# Altium project bms_afe_tester-1_1.PrjPcb (part 1 of 2)
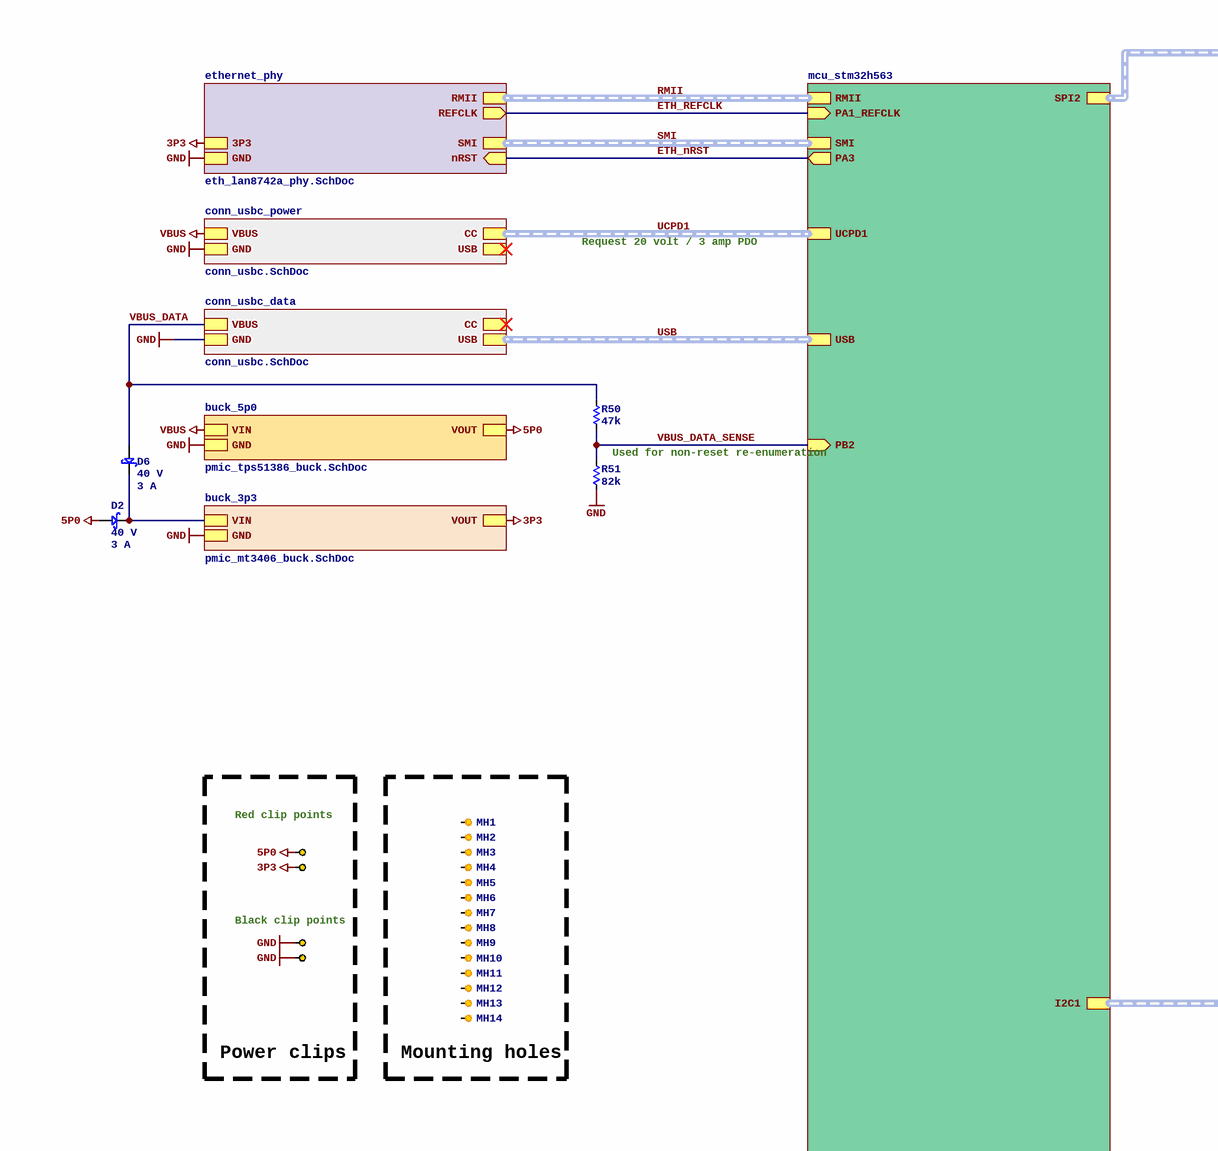
[diagram p0: top.SchDoc, top left]
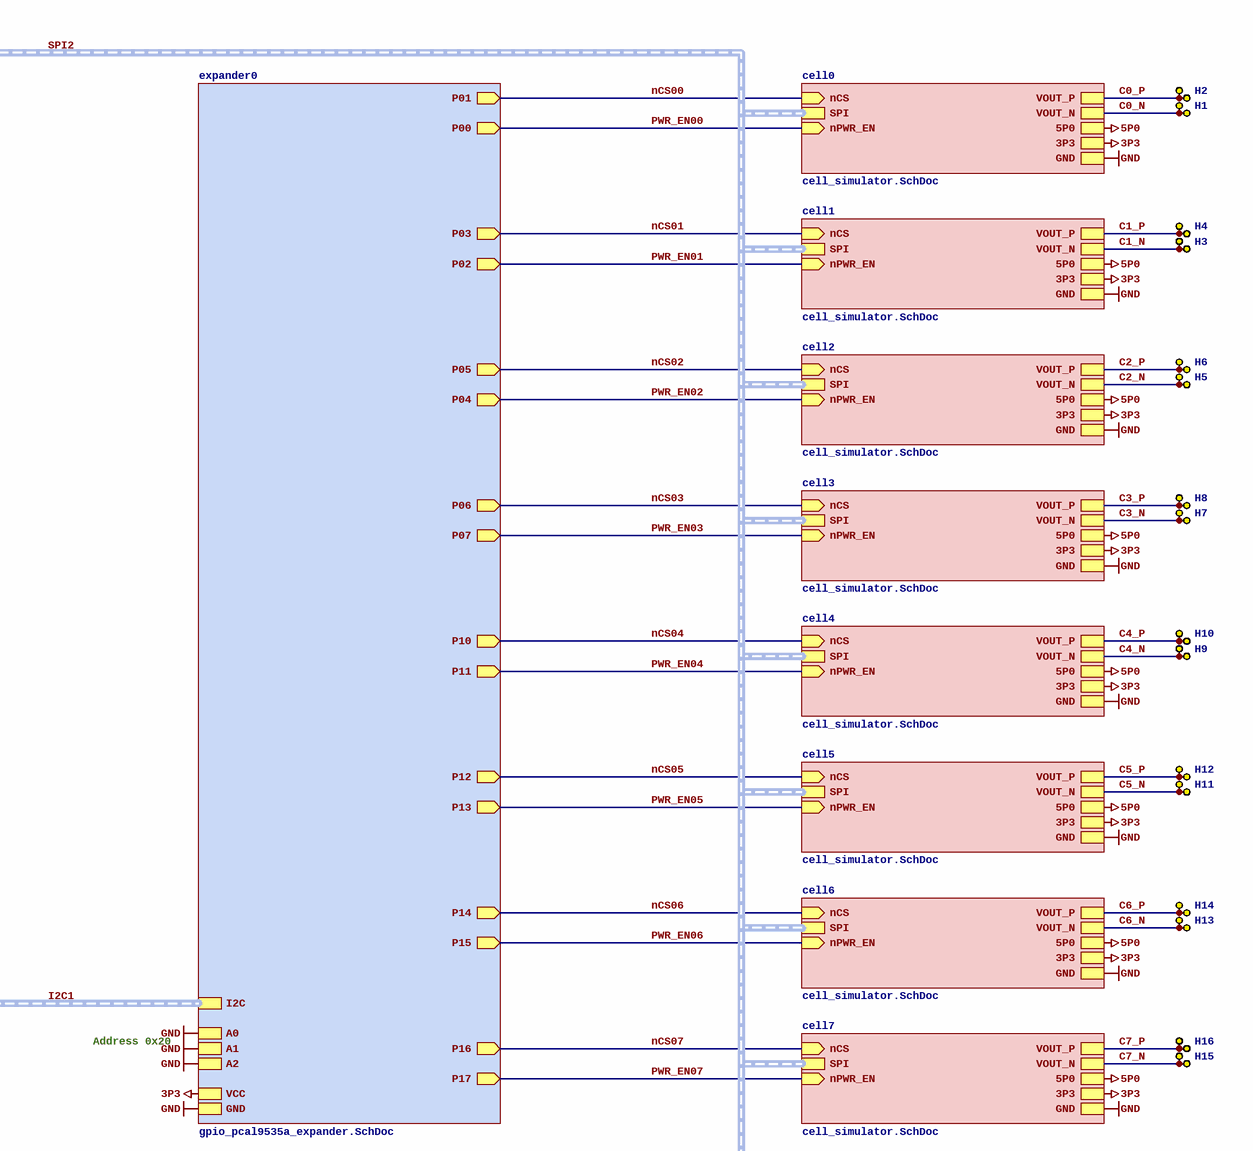
[diagram p1: top.SchDoc, top right]
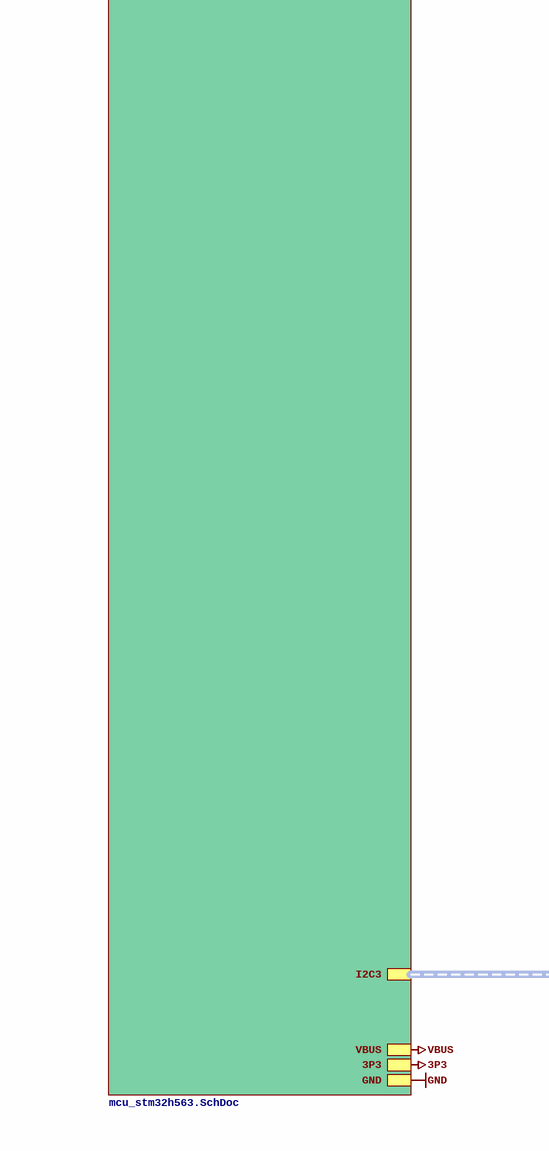
[diagram p2: top.SchDoc, bottom left]
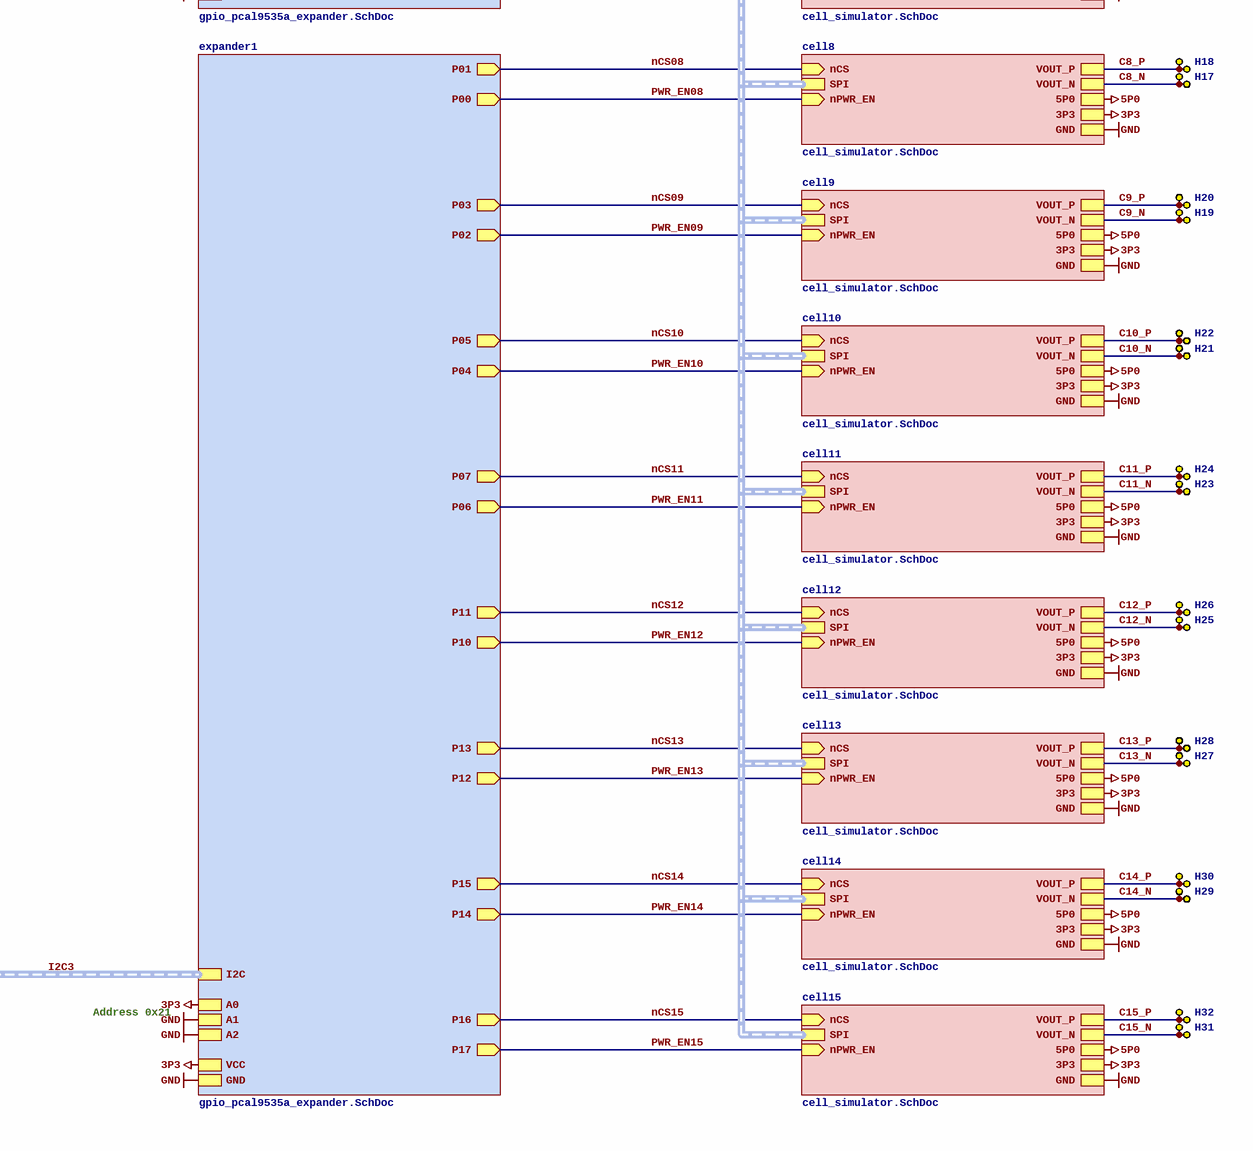
[diagram p3: top.SchDoc, bottom right]
8 sheets, 598 parts. Net scope: strictly hierarchical (ports join the sheet entries above them; power ports are local).
Board file: bms_afe_tester-1_1.PcbDoc
Sheets:
  top.SchDoc
    mcu_stm32h563 = mcu_stm32h563.SchDoc
    conn_usbc_power = conn_usbc.SchDoc
    ethernet_phy = eth_lan8742a_phy.SchDoc
    conn_usbc_data = conn_usbc.SchDoc
    buck_3p3 = pmic_mt3406_buck.SchDoc
    cell0 = cell_simulator.SchDoc
    cell1 = cell_simulator.SchDoc
    cell2 = cell_simulator.SchDoc
    cell3 = cell_simulator.SchDoc
    cell4 = cell_simulator.SchDoc
    cell5 = cell_simulator.SchDoc
    cell6 = cell_simulator.SchDoc
    cell7 = cell_simulator.SchDoc
    cell8 = cell_simulator.SchDoc
    cell9 = cell_simulator.SchDoc
    cell10 = cell_simulator.SchDoc
    cell11 = cell_simulator.SchDoc
    cell12 = cell_simulator.SchDoc
    cell13 = cell_simulator.SchDoc
    cell14 = cell_simulator.SchDoc
    cell15 = cell_simulator.SchDoc
    buck_5p0 = pmic_tps51386_buck.SchDoc
    expander0 = gpio_pcal9535a_expander.SchDoc
    expander1 = gpio_pcal9535a_expander.SchDoc

## Sheet top.SchDoc
size C; SheetNumber: 1

### Parts
D2  Vr: 40 V  Current: 3 A  [SMA]  (hidden comment: B340A-13-F)
D6  Vr: 40 V  Current: 3 A  [SMA]  (hidden comment: B340A-13-F)
H1  SMTSO20100CTJ  [SINHOO_SMTSO20100CTJ]  (value not drawn)
H2  SMTSO20100CTJ  [SINHOO_SMTSO20100CTJ]  (value not drawn)
H3  SMTSO20100CTJ  [SINHOO_SMTSO20100CTJ]  (value not drawn)
H4  SMTSO20100CTJ  [SINHOO_SMTSO20100CTJ]  (value not drawn)
H5  SMTSO20100CTJ  [SINHOO_SMTSO20100CTJ]  (value not drawn)
H6  SMTSO20100CTJ  [SINHOO_SMTSO20100CTJ]  (value not drawn)
H7  SMTSO20100CTJ  [SINHOO_SMTSO20100CTJ]  (value not drawn)
H8  SMTSO20100CTJ  [SINHOO_SMTSO20100CTJ]  (value not drawn)
H9  SMTSO20100CTJ  [SINHOO_SMTSO20100CTJ]  (value not drawn)
H10  SMTSO20100CTJ  [SINHOO_SMTSO20100CTJ]  (value not drawn)
H11  SMTSO20100CTJ  [SINHOO_SMTSO20100CTJ]  (value not drawn)
H12  SMTSO20100CTJ  [SINHOO_SMTSO20100CTJ]  (value not drawn)
H13  SMTSO20100CTJ  [SINHOO_SMTSO20100CTJ]  (value not drawn)
H14  SMTSO20100CTJ  [SINHOO_SMTSO20100CTJ]  (value not drawn)
H15  SMTSO20100CTJ  [SINHOO_SMTSO20100CTJ]  (value not drawn)
H16  SMTSO20100CTJ  [SINHOO_SMTSO20100CTJ]  (value not drawn)
H17  SMTSO20100CTJ  [SINHOO_SMTSO20100CTJ]  (value not drawn)
H18  SMTSO20100CTJ  [SINHOO_SMTSO20100CTJ]  (value not drawn)
H19  SMTSO20100CTJ  [SINHOO_SMTSO20100CTJ]  (value not drawn)
H20  SMTSO20100CTJ  [SINHOO_SMTSO20100CTJ]  (value not drawn)
H21  SMTSO20100CTJ  [SINHOO_SMTSO20100CTJ]  (value not drawn)
H22  SMTSO20100CTJ  [SINHOO_SMTSO20100CTJ]  (value not drawn)
H23  SMTSO20100CTJ  [SINHOO_SMTSO20100CTJ]  (value not drawn)
H24  SMTSO20100CTJ  [SINHOO_SMTSO20100CTJ]  (value not drawn)
H25  SMTSO20100CTJ  [SINHOO_SMTSO20100CTJ]  (value not drawn)
H26  SMTSO20100CTJ  [SINHOO_SMTSO20100CTJ]  (value not drawn)
H27  SMTSO20100CTJ  [SINHOO_SMTSO20100CTJ]  (value not drawn)
H28  SMTSO20100CTJ  [SINHOO_SMTSO20100CTJ]  (value not drawn)
H29  SMTSO20100CTJ  [SINHOO_SMTSO20100CTJ]  (value not drawn)
H30  SMTSO20100CTJ  [SINHOO_SMTSO20100CTJ]  (value not drawn)
H31  SMTSO20100CTJ  [SINHOO_SMTSO20100CTJ]  (value not drawn)
H32  SMTSO20100CTJ  [SINHOO_SMTSO20100CTJ]  (value not drawn)
MH1  HOLE_M3  [HOLE_M3]  (value not drawn)  (no BOM)
MH2  HOLE_M3  [HOLE_M3]  (value not drawn)  (no BOM)
MH3  HOLE_M3  [HOLE_M3]  (value not drawn)  (no BOM)
MH4  HOLE_M3  [HOLE_M3]  (value not drawn)  (no BOM)
MH5  HOLE_M3  [HOLE_M3]  (value not drawn)  (no BOM)
MH6  HOLE_M3  [HOLE_M3]  (value not drawn)  (no BOM)
MH7  HOLE_M3  [HOLE_M3]  (value not drawn)  (no BOM)
MH8  HOLE_M3  [HOLE_M3]  (value not drawn)  (no BOM)
MH9  HOLE_M3  [HOLE_M3]  (value not drawn)  (no BOM)
MH10  HOLE_M3  [HOLE_M3]  (value not drawn)  (no BOM)
MH11  HOLE_M3  [HOLE_M3]  (value not drawn)  (no BOM)
MH12  HOLE_M3  [HOLE_M3]  (value not drawn)  (no BOM)
MH13  HOLE_M3  [HOLE_M3]  (value not drawn)  (no BOM)
MH14  HOLE_M3  [HOLE_M3]  (value not drawn)  (no BOM)
R50  value 47k  [R0402]  (hidden comment: 0402WGF4702TCE)
R51  value 82k  [R0402]  (hidden comment: FRC0402F8202TS)
TP4  RH-5000  [TP_RH-5000]  (value not drawn)
TP5  RH-5001  [TP_RH-5001]  (value not drawn)
TP6  RH-5000  [TP_RH-5000]  (value not drawn)
TP7  RH-5001  [TP_RH-5001]  (value not drawn)
TP8  RH-5000  [TP_RH-5000]  (value not drawn)
TP9  RH-5001  [TP_RH-5001]  (value not drawn)
TP10  RH-5000  [TP_RH-5000]  (value not drawn)
TP11  RH-5001  [TP_RH-5001]  (value not drawn)
TP12  RH-5000  [TP_RH-5000]  (value not drawn)
TP13  RH-5001  [TP_RH-5001]  (value not drawn)
TP14  RH-5000  [TP_RH-5000]  (value not drawn)
TP15  RH-5001  [TP_RH-5001]  (value not drawn)
TP16  RH-5000  [TP_RH-5000]  (value not drawn)
TP17  RH-5001  [TP_RH-5001]  (value not drawn)
TP18  RH-5000  [TP_RH-5000]  (value not drawn)
TP19  RH-5001  [TP_RH-5001]  (value not drawn)
TP20  RH-5000  [TP_RH-5000]  (value not drawn)
TP21  RH-5001  [TP_RH-5001]  (value not drawn)
TP22  RH-5000  [TP_RH-5000]  (value not drawn)
TP23  RH-5001  [TP_RH-5001]  (value not drawn)
TP24  RH-5000  [TP_RH-5000]  (value not drawn)
TP25  RH-5001  [TP_RH-5001]  (value not drawn)
TP26  RH-5000  [TP_RH-5000]  (value not drawn)
TP27  RH-5001  [TP_RH-5001]  (value not drawn)
TP28  RH-5000  [TP_RH-5000]  (value not drawn)
TP29  RH-5001  [TP_RH-5001]  (value not drawn)
TP30  RH-5000  [TP_RH-5000]  (value not drawn)
TP31  RH-5001  [TP_RH-5001]  (value not drawn)
TP32  RH-5000  [TP_RH-5000]  (value not drawn)
TP33  RH-5000  [TP_RH-5000]  (value not drawn)
TP34  RH-5001  [TP_RH-5001]  (value not drawn)
TP35  RH-5000  [TP_RH-5000]  (value not drawn)
TP36  RH-5000  [TP_RH-5000]  (value not drawn)
TP38  RH-5001  [TP_RH-5001]  (value not drawn)
TP39  RH-5001  [TP_RH-5001]  (value not drawn)
TP43  RH-5001  [TP_RH-5001]  (value not drawn)

### Blocks framed on the sheet
Power clips: TP33 TP35 TP39 TP43
Mounting holes: MH1-MH14

### Sub-sheets
buck_3p3 = pmic_mt3406_buck.SchDoc: GND, VIN, VOUT
buck_5p0 = pmic_tps51386_buck.SchDoc: GND, VOUT, VIN
cell0 = cell_simulator.SchDoc: VOUT_P, GND, 5P0, VOUT_N, SPI (harness SPI), nCS (in), nPWR_EN (in), 3P3
cell1 = cell_simulator.SchDoc: VOUT_P, VOUT_N, SPI (harness SPI), nCS (in), nPWR_EN (in), GND, 5P0, 3P3
cell2 = cell_simulator.SchDoc: VOUT_P, VOUT_N, SPI (harness SPI), nCS (in), nPWR_EN (in), GND, 5P0, 3P3
cell3 = cell_simulator.SchDoc: VOUT_P, VOUT_N, SPI (harness SPI), nCS (in), nPWR_EN (in), GND, 5P0, 3P3
cell4 = cell_simulator.SchDoc: VOUT_P, VOUT_N, SPI (harness SPI), nCS (in), nPWR_EN (in), GND, 5P0, 3P3
cell5 = cell_simulator.SchDoc: VOUT_P, VOUT_N, SPI (harness SPI), nCS (in), nPWR_EN (in), GND, 5P0, 3P3
cell6 = cell_simulator.SchDoc: VOUT_P, VOUT_N, SPI (harness SPI), nCS (in), nPWR_EN (in), GND, 5P0, 3P3
cell7 = cell_simulator.SchDoc: VOUT_P, VOUT_N, SPI (harness SPI), nCS (in), nPWR_EN (in), GND, 5P0, 3P3
cell8 = cell_simulator.SchDoc: VOUT_P, VOUT_N, SPI (harness SPI), nCS (in), nPWR_EN (in), GND, 5P0, 3P3
cell9 = cell_simulator.SchDoc: VOUT_P, VOUT_N, SPI (harness SPI), nCS (in), nPWR_EN (in), GND, 5P0, 3P3
cell10 = cell_simulator.SchDoc: VOUT_P, VOUT_N, SPI (harness SPI), nCS (in), nPWR_EN (in), GND, 5P0, 3P3
cell11 = cell_simulator.SchDoc: VOUT_P, VOUT_N, SPI (harness SPI), nCS (in), nPWR_EN (in), GND, 5P0, 3P3
cell12 = cell_simulator.SchDoc: VOUT_P, VOUT_N, SPI (harness SPI), nCS (in), nPWR_EN (in), GND, 5P0, 3P3
cell13 = cell_simulator.SchDoc: VOUT_P, VOUT_N, SPI (harness SPI), nCS (in), nPWR_EN (in), GND, 5P0, 3P3
cell14 = cell_simulator.SchDoc: VOUT_P, VOUT_N, SPI (harness SPI), nCS (in), nPWR_EN (in), GND, 5P0, 3P3
cell15 = cell_simulator.SchDoc: VOUT_P, VOUT_N, SPI (harness SPI), nCS (in), nPWR_EN (in), GND, 5P0, 3P3
conn_usbc_data = conn_usbc.SchDoc: USB (harness DIFF), GND, VBUS, CC (harness CC)
conn_usbc_power = conn_usbc.SchDoc: USB (harness DIFF), GND, VBUS, CC (harness CC)
ethernet_phy = eth_lan8742a_phy.SchDoc: 3P3, GND, REFCLK (out), RMII (harness RMII), nRST (in), SMI (harness SMI)
expander0 = gpio_pcal9535a_expander.SchDoc: A0, A1, GND, VCC, P06 (out), P07 (out), P10 (out), P11 (out), P12 (out), P13 (out), P14 (out), P15 (out), P16 (out), P17 (out), I2C (harness I2C), A2, P01 (out), P00 (out), P05 (out), P04 (out), P03 (out), P02 (out)
expander1 = gpio_pcal9535a_expander.SchDoc: A0, A1, GND, VCC, I2C (harness I2C), A2, P11 (out), P10 (out), P13 (out), P12 (out), P15 (out), P14 (out), P16 (out), P17 (out), P07 (out), P06 (out), P05 (out), P04 (out), P03 (out), P02 (out), P01 (out), P00 (out)
mcu_stm32h563 = mcu_stm32h563.SchDoc: GND, 3P3, PA1_REFCLK (in), RMII (harness RMII), SMI (harness SMI), VBUS, USB (harness DIFF), PA3 (out), UCPD1 (harness CC), SPI2 (harness SPI), I2C1 (harness I2C), I2C3 (harness I2C), PB2 (in)

### Nets
3P3: TP35.1 ; sheet mcu_stm32h563/3P3, sheet ethernet_phy/3P3, sheet buck_3p3/VOUT, sheet cell0/3P3, sheet cell1/3P3, sheet cell2/3P3, sheet cell3/3P3, sheet cell4/3P3, sheet cell5/3P3, sheet cell6/3P3, sheet cell7/3P3, sheet cell8/3P3, sheet cell9/3P3, sheet cell10/3P3, sheet cell11/3P3, sheet cell12/3P3, sheet cell13/3P3, sheet cell14/3P3, sheet cell15/3P3, sheet expander0/VCC, sheet expander1/A0, sheet expander1/VCC
5P0: D2.1 TP33.1 ; sheet cell0/5P0, sheet cell1/5P0, sheet cell2/5P0, sheet cell3/5P0, sheet cell4/5P0, sheet cell5/5P0, sheet cell6/5P0, sheet cell7/5P0, sheet cell8/5P0, sheet cell9/5P0, sheet cell10/5P0, sheet cell11/5P0, sheet cell12/5P0, sheet cell13/5P0, sheet cell14/5P0, sheet cell15/5P0, sheet buck_5p0/VOUT
GND: R51.1 TP39.1 TP43.1 ; sheet mcu_stm32h563/GND, sheet conn_usbc_power/GND, sheet ethernet_phy/GND, sheet conn_usbc_data/GND, sheet buck_3p3/GND, sheet cell0/GND, sheet cell1/GND, sheet cell2/GND, sheet cell3/GND, sheet cell4/GND, sheet cell5/GND, sheet cell6/GND, sheet cell7/GND, sheet cell8/GND, sheet cell9/GND, sheet cell10/GND, sheet cell11/GND, sheet cell12/GND, sheet cell13/GND, sheet cell14/GND, sheet cell15/GND, sheet buck_5p0/GND, sheet expander0/A0, sheet expander0/A1, sheet expander0/GND, sheet expander0/A2, sheet expander1/A1, sheet expander1/GND, sheet expander1/A2
VBUS: sheet mcu_stm32h563/VBUS, sheet conn_usbc_power/VBUS, sheet buck_5p0/VIN
C0_N: H1.1 TP5.1 ; sheet cell0/VOUT_N
C0_P: H2.1 TP4.1 ; sheet cell0/VOUT_P
C1_N: H3.1 TP7.1 ; sheet cell1/VOUT_N
C1_P: H4.1 TP6.1 ; sheet cell1/VOUT_P
C2_N: H5.1 TP9.1 ; sheet cell2/VOUT_N
C2_P: H6.1 TP8.1 ; sheet cell2/VOUT_P
C3_N: H7.1 TP11.1 ; sheet cell3/VOUT_N
C3_P: H8.1 TP10.1 ; sheet cell3/VOUT_P
C4_N: H9.1 TP13.1 ; sheet cell4/VOUT_N
C4_P: H10.1 TP12.1 ; sheet cell4/VOUT_P
C5_N: H11.1 TP15.1 ; sheet cell5/VOUT_N
C5_P: H12.1 TP14.1 ; sheet cell5/VOUT_P
C6_N: H13.1 TP17.1 ; sheet cell6/VOUT_N
C6_P: H14.1 TP16.1 ; sheet cell6/VOUT_P
C7_N: H15.1 TP19.1 ; sheet cell7/VOUT_N
C7_P: H16.1 TP18.1 ; sheet cell7/VOUT_P
C8_N: H17.1 TP21.1 ; sheet cell8/VOUT_N
C8_P: H18.1 TP20.1 ; sheet cell8/VOUT_P
C9_N: H19.1 TP23.1 ; sheet cell9/VOUT_N
C9_P: H20.1 TP22.1 ; sheet cell9/VOUT_P
C10_N: H21.1 TP25.1 ; sheet cell10/VOUT_N
C10_P: H22.1 TP24.1 ; sheet cell10/VOUT_P
C11_N: H23.1 TP27.1 ; sheet cell11/VOUT_N
C11_P: H24.1 TP26.1 ; sheet cell11/VOUT_P
C12_N: H25.1 TP29.1 ; sheet cell12/VOUT_N
C12_P: H26.1 TP28.1 ; sheet cell12/VOUT_P
C13_N: H27.1 TP31.1 ; sheet cell13/VOUT_N
C13_P: H28.1 TP30.1 ; sheet cell13/VOUT_P
C14_N: H29.1 TP34.1 ; sheet cell14/VOUT_N
C14_P: H30.1 TP32.1 ; sheet cell14/VOUT_P
C15_N: H31.1 TP38.1 ; sheet cell15/VOUT_N
C15_P: H32.1 TP36.1 ; sheet cell15/VOUT_P
ETH_nRST: sheet mcu_stm32h563/PA3, sheet ethernet_phy/nRST
ETH_REFCLK: sheet mcu_stm32h563/PA1_REFCLK, sheet ethernet_phy/REFCLK
nCS00: sheet cell0/nCS, sheet expander0/P01
nCS01: sheet cell1/nCS, sheet expander0/P03
nCS02: sheet cell2/nCS, sheet expander0/P05
nCS03: sheet cell3/nCS, sheet expander0/P06
nCS04: sheet cell4/nCS, sheet expander0/P10
nCS05: sheet cell5/nCS, sheet expander0/P12
nCS06: sheet cell6/nCS, sheet expander0/P14
nCS07: sheet cell7/nCS, sheet expander0/P16
nCS08: sheet cell8/nCS, sheet expander1/P01
nCS09: sheet cell9/nCS, sheet expander1/P03
nCS10: sheet cell10/nCS, sheet expander1/P05
nCS11: sheet cell11/nCS, sheet expander1/P07
nCS12: sheet cell12/nCS, sheet expander1/P11
nCS13: sheet cell13/nCS, sheet expander1/P13
nCS14: sheet cell14/nCS, sheet expander1/P15
nCS15: sheet cell15/nCS, sheet expander1/P16
PWR_EN00: sheet cell0/nPWR_EN, sheet expander0/P00
PWR_EN01: sheet cell1/nPWR_EN, sheet expander0/P02
PWR_EN02: sheet cell2/nPWR_EN, sheet expander0/P04
PWR_EN03: sheet cell3/nPWR_EN, sheet expander0/P07
PWR_EN04: sheet cell4/nPWR_EN, sheet expander0/P11
PWR_EN05: sheet cell5/nPWR_EN, sheet expander0/P13
PWR_EN06: sheet cell6/nPWR_EN, sheet expander0/P15
PWR_EN07: sheet cell7/nPWR_EN, sheet expander0/P17
PWR_EN08: sheet cell8/nPWR_EN, sheet expander1/P00
PWR_EN09: sheet cell9/nPWR_EN, sheet expander1/P02
PWR_EN10: sheet cell10/nPWR_EN, sheet expander1/P04
PWR_EN11: sheet cell11/nPWR_EN, sheet expander1/P06
PWR_EN12: sheet cell12/nPWR_EN, sheet expander1/P10
PWR_EN13: sheet cell13/nPWR_EN, sheet expander1/P12
PWR_EN14: sheet cell14/nPWR_EN, sheet expander1/P14
PWR_EN15: sheet cell15/nPWR_EN, sheet expander1/P17
VBUS_DATA: D6.1 R50.2 ; sheet conn_usbc_data/VBUS
VBUS_DATA_SENSE: R50.1 R51.2 ; sheet mcu_stm32h563/PB2
NetD2_2: D2.2 D6.2 ; sheet buck_3p3/VIN

Not connected (* = marked no-connect by the designer): MH1 1; MH2 1; MH3 1; MH4 1; MH5 1; MH6 1; MH7 1; MH8 1; MH9 1; MH10 1; MH11 1; MH12 1; MH13 1; MH14 1

### Buses and harness runs
harness I2C1 = sheet expander0/I2C = sheet mcu_stm32h563/I2C1
harness I2C3 = sheet expander1/I2C = sheet mcu_stm32h563/I2C3
harness RMII = sheet ethernet_phy/RMII = sheet mcu_stm32h563/RMII
harness SMI = sheet ethernet_phy/SMI = sheet mcu_stm32h563/SMI
harness SPI2 = sheet cell0/SPI = sheet cell1/SPI = sheet cell2/SPI = sheet cell3/SPI = sheet cell4/SPI = sheet cell5/SPI = sheet cell6/SPI = sheet cell7/SPI = sheet cell8/SPI = sheet cell9/SPI = sheet cell10/SPI = sheet cell11/SPI = sheet cell12/SPI = sheet cell13/SPI = sheet cell14/SPI = sheet cell15/SPI = sheet mcu_stm32h563/SPI2
harness UCPD1 = sheet conn_usbc_power/CC = sheet mcu_stm32h563/UCPD1
harness USB = sheet conn_usbc_data/USB = sheet mcu_stm32h563/USB

### Notes on the sheet
- Request 20 volt / 3 amp PDO
- Used for non-reset re-enumeration
- Red clip points
- (near TP39) Black clip points
- Address 0x20
- Address 0x21

### Library data of the parts
D2 D6 = B340A-13-F: Rectifier Diode, Schottky, 1 Phase, 1 Element, 3A, 40V V(RRM), Silicon; Manufacturer: Diodes; Supplier 1: DigiKey; ComponentLink1URL: https://www.diodes.com/assets/Datasheets/ds30891.pdf; Supplier Part Number 1: B340A-FDICT-ND; Manufacturer Part Number: B340A-13-F; ComponentLink1Description: Datasheet; Supplier 2: LCSC; Supplier Part Number 2: C85098; Diode Type: Schottky; Supplier 3: Mouser; Supplier Part Number 3: 621-B340A-F
H1-H32 = SMTSO20100CTJ: Standoff M2 x 0.4, tin-plated, 10 mm height; Manufacturer: Sinhoo; Manufacturer Part Number: SMTSO20100CTJ; ComponentLink1Description: Catalog; ComponentLink1URL: https://www.lcsc.com/datasheet/C2928171.pdf; Supplier 2: LCSC; Supplier Part Number 2: C2928171
R50 = 0402WGF4702TCE: Manufacturer: UNI-ROYAL(Uniroyal Elec); Power Rating (mW): 62.5; Tolerance: 1%; Temperature Coefficient: ±100ppm/?; Manufacturer Part Number: 0402WGF4702TCE; Package: 0402; Supplier 2: LCSC; Supplier Part Number 2: C25792; ComponentLink1Description: Datasheet; ComponentLink1URL: https://wmsc.lcsc.com/wmsc/upload/file/pdf/v2/lcsc/2206010100_UNI-ROYAL-Uniroyal-Elec-0402WGF4702TCE_C25792.pdf
R51 = FRC0402F8202TS: Manufacturer: FOJAN; Power Rating (mW): 62.5; Tolerance: 1%; Temperature Coefficient: ±100ppm/?; Manufacturer Part Number: FRC0402F8202TS; Package: 0402; Supplier 2: LCSC; Supplier Part Number 2: C2909388; ComponentLink1Description: Datasheet; ComponentLink1URL: https://datasheet.lcsc.com/lcsc/2308241009_FOJAN-FRC0402F8202TS_C2909388.pdf
TP4 TP6 TP8 TP10 TP12 TP14 TP16 TP18 TP20 TP22 TP24 TP26 TP28 TP30 TP32 TP33 TP35 TP36 = RH-5000: Red through-hole PCB test point; Manufacturer: ronghe; ComponentLink1Description: Datasheet; ComponentLink1URL: https://datasheet.lcsc.com/lcsc/2307040929_ronghe-RH-5000_C5277086.pdf; Manufacturer Part Number: RH-5000; Supplier 2: LCSC; Supplier Part Number 2: C5277086
TP5 TP7 TP9 TP11 TP13 TP15 TP17 TP19 TP21 TP23 TP25 TP27 TP29 TP31 TP34 TP38 TP39 TP43 = RH-5001: Black through-hole PCB test point; Manufacturer: ronghe; ComponentLink1Description: Datasheet; ComponentLink1URL: https://datasheet.lcsc.com/lcsc/2307040929_ronghe-RH-5000_C5277086.pdf; Manufacturer Part Number: RH-5001; Supplier 2: LCSC; Supplier Part Number 2: C5199801
MH1-MH14 = HOLE_M3: Manufacturer Part Number: HOLE_M3

## Sheet mcu_stm32h563.SchDoc
size C; SheetNumber: 2
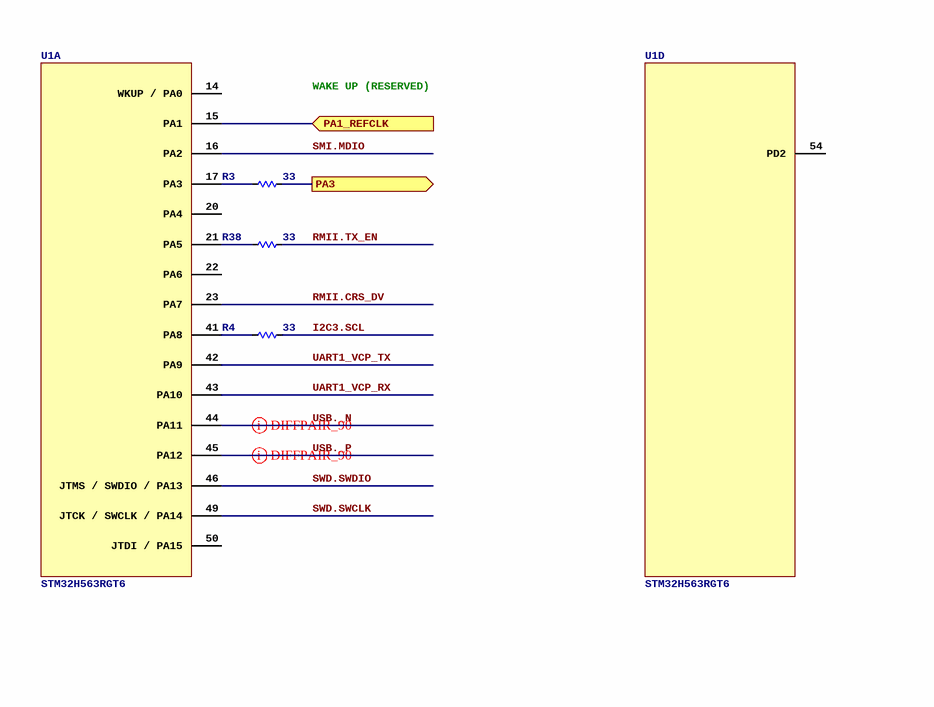
[diagram p4: mcu_stm32h563.SchDoc, top left]
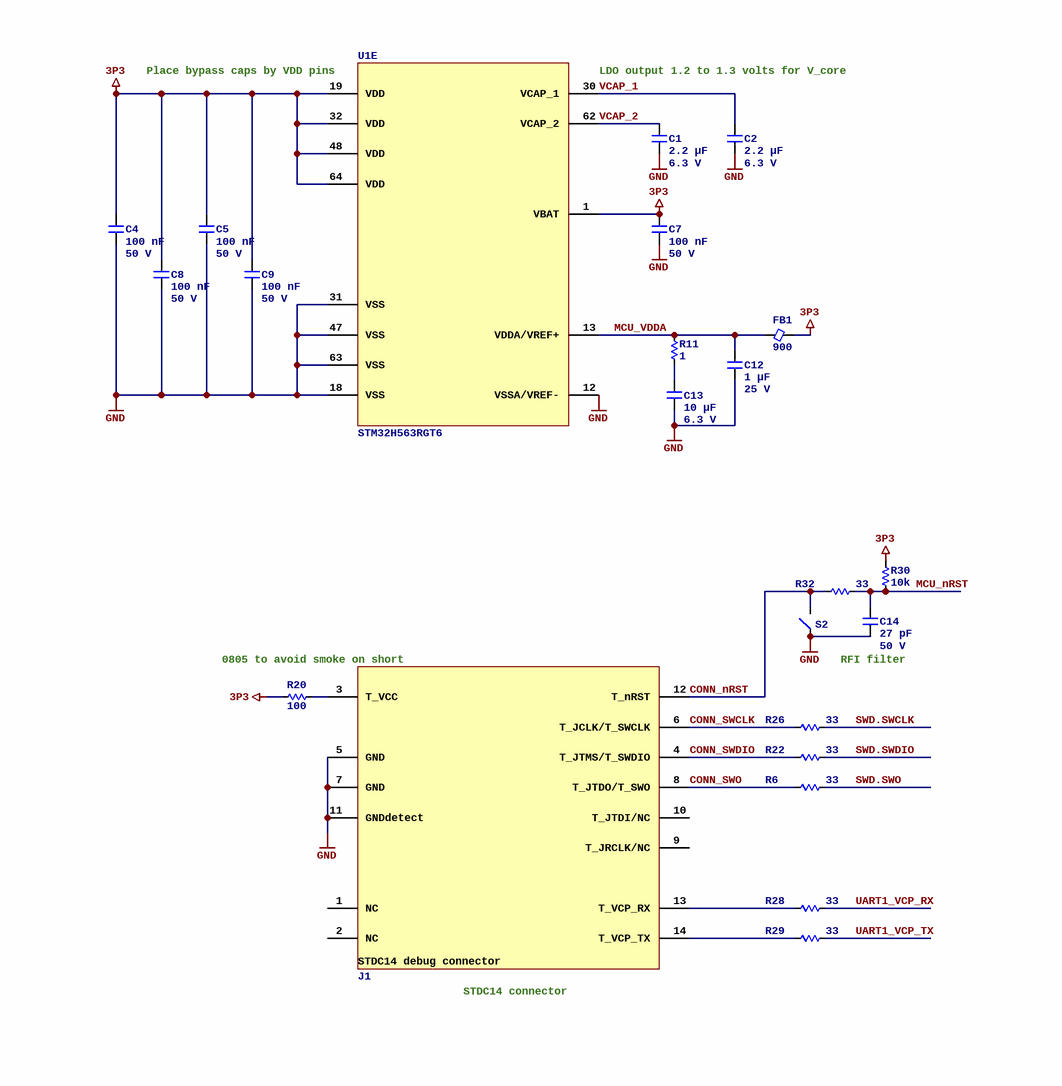
[diagram p5: mcu_stm32h563.SchDoc, top right]
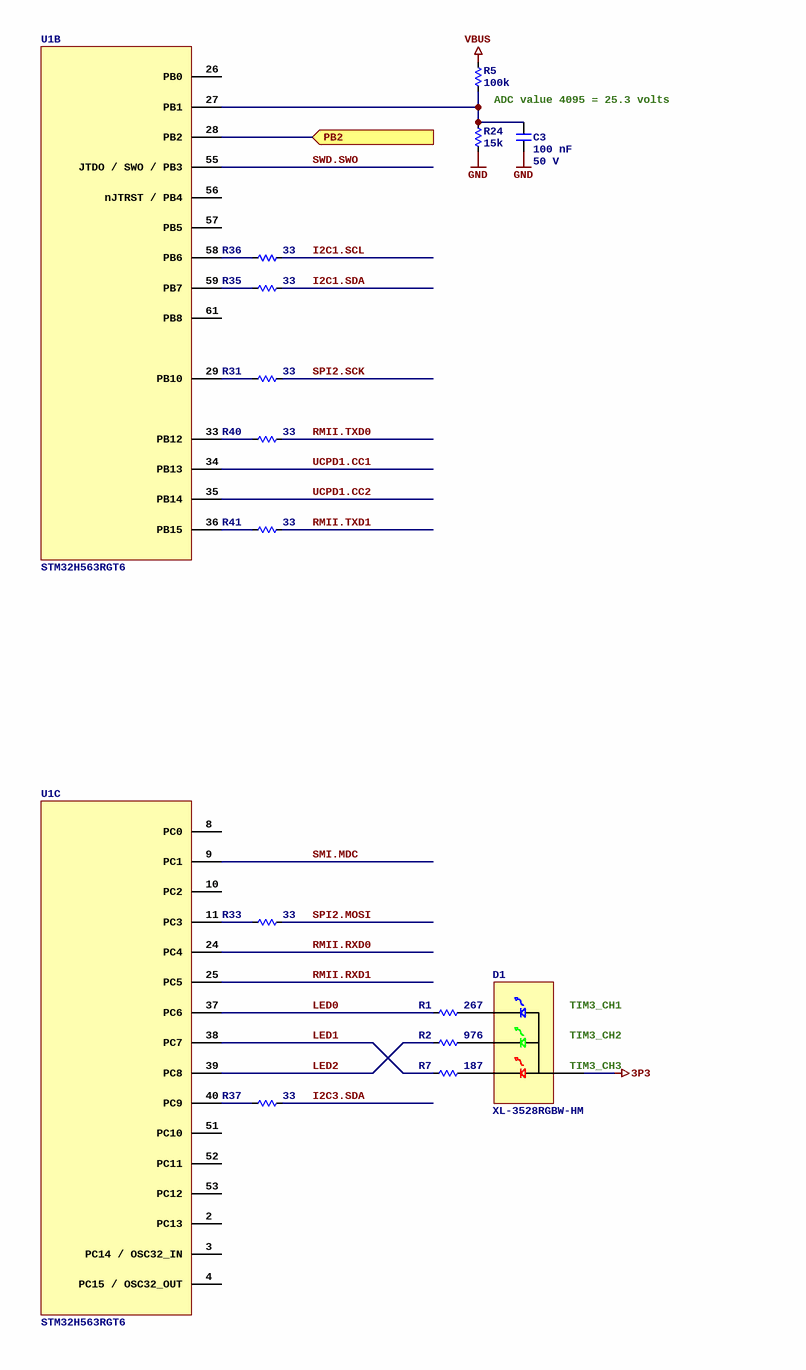
[diagram p6: mcu_stm32h563.SchDoc, bottom left]
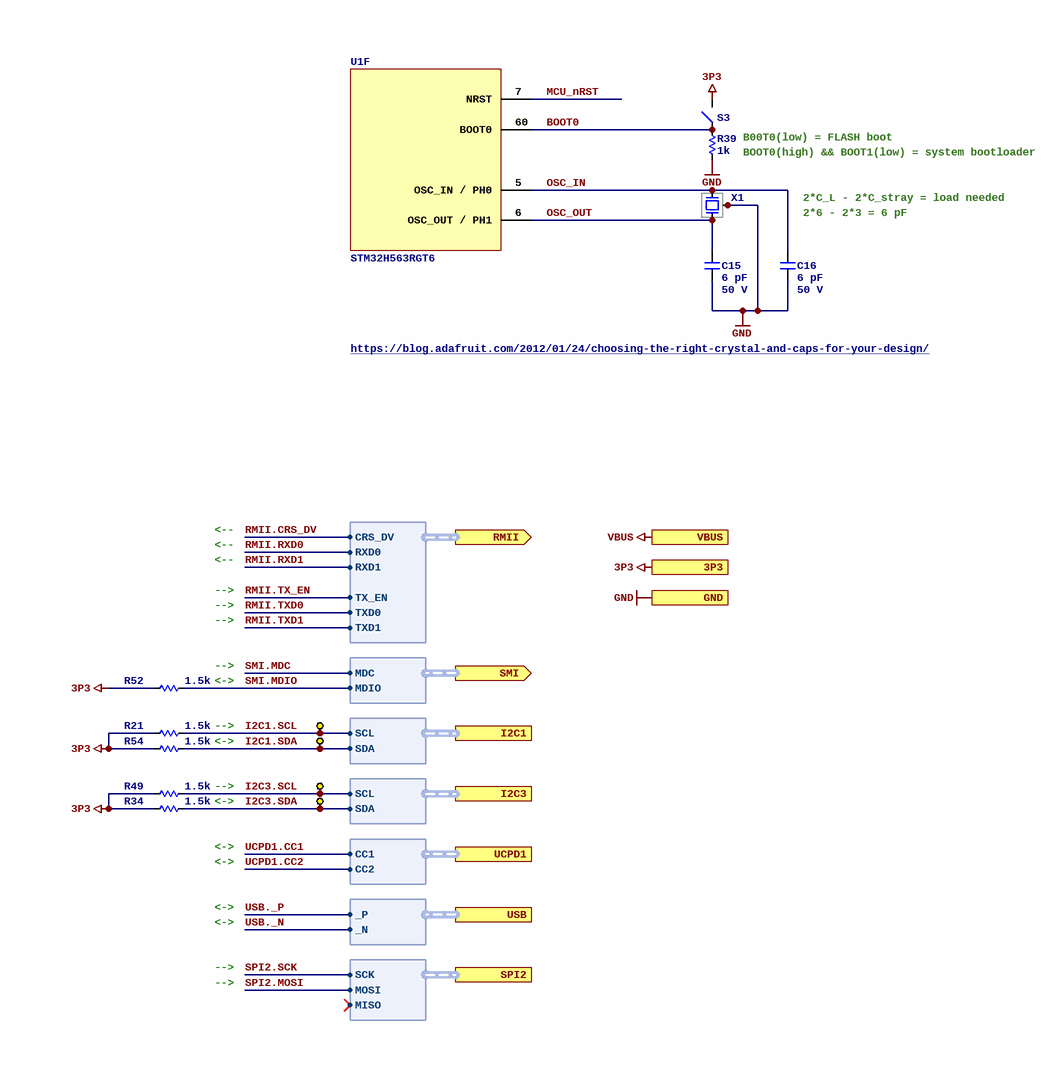
[diagram p7: mcu_stm32h563.SchDoc, bottom right]

### Parts
C1  Capacitance: 2.2 µF  Voltage Rating: 6.3 V  [C0603]  (hidden comment: GCM188R70J225KE22D)
C2  Capacitance: 2.2 µF  Voltage Rating: 6.3 V  [C0603]  (hidden comment: GCM188R70J225KE22D)
C3  Capacitance: 100 nF  Voltage Rating: 50 V  [C0402]  (hidden comment: CL05B104KB54PNC)
C4  Capacitance: 100 nF  Voltage Rating: 50 V  [C0402]  (hidden comment: CL05B104KB54PNC)
C5  Capacitance: 100 nF  Voltage Rating: 50 V  [C0402]  (hidden comment: CL05B104KB54PNC)
C7  Capacitance: 100 nF  Voltage Rating: 50 V  [C0402]  (hidden comment: CL05B104KB54PNC)
C8  Capacitance: 100 nF  Voltage Rating: 50 V  [C0402]  (hidden comment: CL05B104KB54PNC)
C9  Capacitance: 100 nF  Voltage Rating: 50 V  [C0402]  (hidden comment: CL05B104KB54PNC)
C12  Capacitance: 1 µF  Voltage Rating: 25 V  [C0603]  (hidden comment: CL10B105KA8NNNC)
C13  Capacitance: 10 µF  Voltage Rating: 6.3 V  [C0805]  (hidden comment: CC0805KKX7R5BB106)
C14  Capacitance: 27 pF  Voltage Rating: 50 V  [C0402]  (hidden comment: CC0402JRNPO9BN270)
C15  Capacitance: 6 pF  Voltage Rating: 50 V  [C0402]  (hidden comment: CC0402CRNPO9BN6R0)
C16  Capacitance: 6 pF  Voltage Rating: 50 V  [C0402]  (hidden comment: CC0402CRNPO9BN6R0)
D1  XL-3528RGBW-HM  [LED_RGB_SMD3528-4P]
FB1  Current Rating (mA): 900  [FB0402]  (hidden comment: BLM15PX601SN1D)
J1  FTSH-107-01-L-DV-K-A  [SAMTEC_FTSH-107-01-L-DV-K-A]  (value not drawn)
R1  value 267  [R0402]  (hidden comment: FRC0402F2670TS)
R2  value 976  [R0402]  (hidden comment: RTT029760FTH)
R3  value 33  [R0402]  (hidden comment: CRCW040233R0FKED)
R4  value 33  [R0402]  (hidden comment: CRCW040233R0FKED)
R5  value 100k  [R0402]  (hidden comment: 0402WGF1003TCE)
R6  value 33  [R0402]  (hidden comment: CRCW040233R0FKED)
R7  value 187  [R0402]  (hidden comment: ERJ2RKF1870X)
R11  value 1  [R0402]  (hidden comment: CRCW04021R00FKEDC)
R20  value 100  [R0805]  (hidden comment: AR05FTC1000)
R21  value 1.5k  [R0402]  (hidden comment: 0402WGF1501TCE)
R22  value 33  [R0402]  (hidden comment: CRCW040233R0FKED)
R24  value 15k  [R0402]  (hidden comment: 0402WGF1502TCE)
R26  value 33  [R0402]  (hidden comment: CRCW040233R0FKED)
R28  value 33  [R0402]  (hidden comment: CRCW040233R0FKED)
R29  value 33  [R0402]  (hidden comment: CRCW040233R0FKED)
R30  value 10k  [R0402]  (hidden comment: 0402WGF1002TCE)
R31  value 33  [R0402]  (hidden comment: CRCW040233R0FKED)
R32  value 33  [R0402]  (hidden comment: CRCW040233R0FKED)
R33  value 33  [R0402]  (hidden comment: CRCW040233R0FKED)
R34  value 1.5k  [R0402]  (hidden comment: 0402WGF1501TCE)
R35  value 33  [R0402]  (hidden comment: CRCW040233R0FKED)
R36  value 33  [R0402]  (hidden comment: CRCW040233R0FKED)
R37  value 33  [R0402]  (hidden comment: CRCW040233R0FKED)
R38  value 33  [R0402]  (hidden comment: CRCW040233R0FKED)
R39  value 1k  [R0402]  (hidden comment: 0402WGF1001TCE)
R40  value 33  [R0402]  (hidden comment: CRCW040233R0FKED)
R41  value 33  [R0402]  (hidden comment: CRCW040233R0FKED)
R49  value 1.5k  [R0402]  (hidden comment: 0402WGF1501TCE)
R52  value 1.5k  [R0402]  (hidden comment: 0402WGF1501TCE)
R54  value 1.5k  [R0402]  (hidden comment: 0402WGF1501TCE)
S2  TS-1092S-B3D2-G  [SWITCH_TS-1092S-B3D2-G]  (value not drawn)
S3  TS-1092S-B3D2-G  [SWITCH_TS-1092S-B3D2-G]  (value not drawn)
TP1  (no value)  [TP_GRABBY]  (no BOM)
TP2  (no value)  [TP_GRABBY]  (no BOM)
TP62  (no value)  [TP_GRABBY]  (no BOM)
TP63  (no value)  [TP_GRABBY]  (no BOM)
U1  STM32H563RGT6  [64TQFP10]  (parts A,B,C,D,E,F of 6)
X1  XRCGB16M000FXN00R0  [4_SMD_2.0X1.6MM]  (value not drawn)

### Ports
3P3, GND, I2C1 (harness I2C), I2C3 (harness I2C), PA1_REFCLK (in), PA3 (out), PB2 (in), RMII (out, harness RMII), SMI (out, harness SMI), SPI2 (harness SPI), UCPD1 (harness CC), USB (harness DIFF), VBUS

### Harnesses
RMII: CRS_DV, RXD0, RXD1, TX_EN, TXD0, TXD1
SMI: MDC, MDIO
DIFF: _P, _N
I2C: SCL, SDA
CC: CC2, CC1
SPI: MISO, MOSI, SCK

### Nets
3P3: C4.1 C5.1 C7.1 C8.1 C9.1 D1.2 FB1.2 R20.2 R21.2 R30.1 R34.2 R49.2 R52.2 R54.2 S3.2 U1.1(VBAT) U1.19(VDD) U1.32(VDD) U1.48(VDD) U1.64(VDD) ; port 3P3
GND: C1.2 C2.2 C3.2 C4.2 C5.2 C7.2 C8.2 C9.2 C12.2 C13.2 C14.2 C15.2 C16.2 J1.5(GND) J1.7(GND) J1.11(GNDdetect) R24.1 R39.2 S2.1 U1.12(VSSA/VREF-) U1.18(VSS) U1.31(VSS) U1.47(VSS) U1.63(VSS) X1.2 X1.4 ; port GND
VBUS: R5.2 ; port VBUS
BOOT0: R39.1 S3.1 U1.60(BOOT0)  [project net BOOT0_2]
CONN_nRST: J1.12(T_nRST) R32.2 S2.2  [project net CONN_nRST_2]
CONN_SWCLK: J1.6(T_JCLK/T_SWCLK) R26.2  [project net CONN_SWCLK_2]
CONN_SWDIO: J1.4(T_JTMS/T_SWDIO) R22.2  [project net CONN_SWDIO_2]
CONN_SWO: J1.8(T_JTDO/T_SWO) R6.2  [project net CONN_SWO_2]
ETH_nRST: R3.1 ; port PA3
ETH_REFCLK: U1.15(PA1) ; port PA1_REFCLK
I2C1.SCL: R21.1 R36.1 TP62.1 ; port I2C1.SCL
I2C1.SDA: R35.1 R54.1 TP63.1 ; port I2C1.SDA
I2C3.SCL: R4.1 R49.1 TP1.1 ; port I2C3.SCL
I2C3.SDA: R34.1 R37.1 TP2.1 ; port I2C3.SDA
LED0: R1.2 U1.37(PC6)  [project net LED0_2]
LED1: R7.2 U1.38(PC7)  [project net LED1_2]
LED2: R2.2 U1.39(PC8)  [project net LED2_2]
MCU_nRST: C14.1 R30.2 R32.1 U1.7(NRST)  [project net MCU_nRST_2]
MCU_VDDA: C12.1 FB1.1 R11.2 U1.13(VDDA/VREF+)  [project net MCU_VDDA_2]
OSC_IN: C16.1 U1.5(OSC_IN_/_PH0) X1.3  [project net OSC_IN_2]
OSC_OUT: C15.1 U1.6(OSC_OUT_/_PH1) X1.1  [project net OSC_OUT_2]
RMII.CRS_DV: U1.23(PA7) ; port RMII.CRS_DV
RMII.RXD0: U1.24(PC4) ; port RMII.RXD0
RMII.RXD1: U1.25(PC5) ; port RMII.RXD1
RMII.TX_EN: R38.1 ; port RMII.TX_EN
RMII.TXD0: R40.1 ; port RMII.TXD0
RMII.TXD1: R41.1 ; port RMII.TXD1
SMI.MDC: U1.9(PC1) ; port SMI.MDC
SMI.MDIO: R52.1 U1.16(PA2) ; port SMI.MDIO
SPI2.MOSI: R33.1 ; port SPI2.MOSI
SPI2.SCK: R31.1 ; port SPI2.SCK
SWD.SWCLK: R26.1 U1.49(JTCK_/_SWCLK_/_PA14)  [project net SWD.SWCLK_2]
SWD.SWDIO: R22.1 U1.46(JTMS_/_SWDIO_/_PA13)  [project net SWD.SWDIO_2]
SWD.SWO: R6.1 U1.55(JTDO_/_SWO_/_PB3)  [project net SWD.SWO_2]
UART1_VCP_RX: R28.1 U1.43(PA10)  [project net UART1_VCP_RX_2]
UART1_VCP_TX: R29.1 U1.42(PA9)  [project net UART1_VCP_TX_2]
UCPD1.CC1: U1.34(PB13) ; port UCPD1.CC1
UCPD1.CC2: U1.35(PB14) ; port UCPD1.CC2
USB._N: U1.44(PA11) ; port USB._N
USB._P: U1.45(PA12) ; port USB._P
VBUS_DATA_SENSE: U1.28(PB2) ; port PB2
VCAP_1: C2.1 U1.30(VCAP_1)  [project net VCAP_1_2]
VCAP_2: C1.1 U1.62(VCAP_2)  [project net VCAP_2_2]
NetC3_1: C3.1 R5.1 R24.2 U1.27(PB1)
NetC13_1: C13.1 R11.1
NetD1_1: D1.1 R7.1
NetD1_3: D1.3 R2.1
NetD1_4: D1.4 R1.1
NetJ1_3: J1.3(T_VCC) R20.1
NetJ1_13: J1.13(T_VCP_RX) R28.2
NetJ1_14: J1.14(T_VCP_TX) R29.2
NetR3_2: R3.2 U1.17(PA3)
NetR4_2: R4.2 U1.41(PA8)
NetR31_2: R31.2 U1.29(PB10)
NetR33_2: R33.2 U1.11(PC3)
NetR35_2: R35.2 U1.59(PB7)
NetR36_2: R36.2 U1.58(PB6)
NetR37_2: R37.2 U1.40(PC9)
NetR38_2: R38.2 U1.21(PA5)
NetR40_2: R40.2 U1.33(PB12)
NetR41_2: R41.2 U1.36(PB15)

Not connected (* = marked no-connect by the designer): J1 1(NC) 2(NC) 9(T_JRCLK/NC) 10(T_JTDI/NC); U1 2(PC13) 3(PC14_/_OSC32_IN) 4(PC15_/_OSC32_OUT) 8(PC0) 10(PC2) 14(WKUP_/_PA0) 20(PA4) 22(PA6) 26(PB0) 50(JTDI_/_PA15) 51(PC10) 52(PC11) 53(PC12) 54(PD2) 56(nJTRST_/_PB4) 57(PB5) 61(PB8)

### Layout directives
differential pair; differential pair class DE_90: USB._N, USB._P

### Notes on the sheet
- WAKE UP (RESERVED)
- (near U1) Place bypass caps by VDD pins
- (near U1) LDO output 1.2 to 1.3 volts for V_core
- 0805 to avoid smoke on short
- RFI filter
- ADC value 4095 = 25.3 volts
- (near J1) STDC14 connector
- B00T0(low) = FLASH boot
- BOOT0(high) && BOOT1(low) = system bootloader
- 2*C_L - 2*C_stray = load needed
- (near C16) 2*6 - 2*3 = 6 pF
- https://blog.adafruit.com/2012/01/24/choosing-the-right-crystal-and-caps-for-your-design/
- <--
- -->
- <->
- (near R52) -->
- (near D1) TIM3_CH1
- (near D1) TIM3_CH2
- (near D1) TIM3_CH3
- (in symbol FTSH-107-01-L-DV-K-A) STDC14 debug connector

### Library data of the parts
C1 C2 = GCM188R70J225KE22D: Manufacturer: Murata Electronics; Dielectric: X7R; ComponentLink1URL: https://wmsc.lcsc.com/wmsc/upload/file/pdf/v2/lcsc/1810311130_Murata-Electronics-GCM188R70J225KE22D_C126582.pdf; ComponentLink1Description: Datasheet; Manufacturer Part Number: GCM188R70J225KE22D; Package: 0603; Supplier 2: LCSC; Supplier Part Number 2: C126582
C3-C5 C7-C9 = CL05B104KB54PNC: Manufacturer: Samsung Electro-Mechanics; Dielectric: X7R; ComponentLink1URL: https://wmsc.lcsc.com/wmsc/upload/file/pdf/v2/lcsc/2304140030_Samsung-Electro-Mechanics-CL05B104KB54PNC_C307331.pdf; ComponentLink1Description: Datasheet; Manufacturer Part Number: CL05B104KB54PNC; Package: 0402; Supplier 2: LCSC; Supplier Part Number 2: C307331
C12 = CL10B105KA8NNNC: Manufacturer: Samsung Electro-Mechanics; Dielectric: X7R; ComponentLink1URL: https://wmsc.lcsc.com/wmsc/upload/file/pdf/v2/lcsc/2304140030_Samsung-Electro-Mechanics-CL10B105KA8NNNC_C29936.pdf; ComponentLink1Description: Datasheet; Manufacturer Part Number: CL10B105KA8NNNC; Package: 0603; Supplier 2: LCSC; Supplier Part Number 2: C29936
C13 = CC0805KKX7R5BB106: Manufacturer: YAGEO; Dielectric: X7R; ComponentLink1URL: https://wmsc.lcsc.com/wmsc/upload/file/pdf/v2/lcsc/2409272300_YAGEO-CC0805KKX7R5BB106_C527225.pdf; ComponentLink1Description: Datasheet; Manufacturer Part Number: CC0805KKX7R5BB106; Package: 0805; Supplier 2: LCSC; Supplier Part Number 2: C527225
C14 = CC0402JRNPO9BN270: Manufacturer: YAGEO; Dielectric: NP0; ComponentLink1URL: https://wmsc.lcsc.com/wmsc/upload/file/pdf/v2/lcsc/2304140030_YAGEO-CC0402JRNPO9BN270_C107002.pdf; ComponentLink1Description: Datasheet; Manufacturer Part Number: CC0402JRNPO9BN270; Package: 0402; Supplier 2: LCSC; Supplier Part Number 2: C107002
C15 C16 = CC0402CRNPO9BN6R0: Manufacturer: YAGEO; Dielectric: NP0; ComponentLink1URL: https://wmsc.lcsc.com/wmsc/upload/file/pdf/v2/lcsc/2007101237_YAGEO-CC0402CRNPO9BN6R0_C700515.pdf; ComponentLink1Description: Datasheet; Manufacturer Part Number: CC0402CRNPO9BN6R0; Package: 0402; Supplier 2: LCSC; Supplier Part Number 2: C700515
D1 = XL-3528RGBW-HM: LED Multi-Color Chip Red/Green/Blue 4-Pin PLCC T/R; Manufacturer: XINGLIGHT; LED Color: RGB; Supplier 1: DigiKey; Supplier Part Number 1: 5962-XL-3528RGBW-HMTR-ND; Manufacturer Part Number: XL-3528RGBW-HM; ComponentLink1Description: Datasheet; ComponentLink1URL: https://mm.digikey.com/Volume0/opasdata/d220001/medias/docus/8903/XL-3528RGBW-HM.pdf; Supplier 2: LCSC; Supplier Part Number 2: C2843813
FB1 = BLM15PX601SN1D: Manufacturer: Murata Electronics; Z @ 100 MHz: 600; DCR (mOhms): 230; ComponentLink1URL: https://wmsc.lcsc.com/wmsc/upload/file/pdf/v2/lcsc/2304140030_Murata-Electronics-BLM15PX601SN1D_C160977.pdf; ComponentLink1Description: Datasheet; Manufacturer Part Number: BLM15PX601SN1D; Supplier 2: LCSC; Supplier Part Number 2: C160977; Package: 0402
J1 = FTSH-107-01-L-DV-K-A: Connector Header Surface Mount 14 position 0.050" (1.27mm); Manufacturer: Samtec; Supplier 1: DigiKey; Supplier Part Number 1: FTSH-107-01-L-DV-K-A-ND; Manufacturer Part Number: FTSH-107-01-L-DV-K-A; Supplier 2: LCSC; Supplier Part Number 2: C5563894; Supplier 3: Mouser; Supplier Part Number 3: 200-FTSH10701LDVKA; ComponentLink1Description: Datasheet; ComponentLink1URL: https://mm.digikey.com/Volume0/opasdata/d220001/medias/docus/6209/ftsh-1xx-xx-xxx-dv-xxx-xxx-x-xx-mkt.pdf
R1 = FRC0402F2670TS: Manufacturer: FOJAN; Tolerance: 1%; Temperature Coefficient: ±100ppm/?; Power Rating (mW): 62.5; ComponentLink1Description: Datasheet; ComponentLink1URL: https://datasheet.lcsc.com/lcsc/2308241947_FOJAN-FRC0402F2670TS_C2998075.pdf; Manufacturer Part Number: FRC0402F2670TS; Package: 0402; Supplier 2: LCSC; Supplier Part Number 2: C2998075
R2 = RTT029760FTH: Manufacturer: RALEC; Tolerance: 1%; Temperature Coefficient: ±100ppm/?; Power Rating (mW): 62.5; ComponentLink1Description: Datasheet; ComponentLink1URL: https://wmsc.lcsc.com/wmsc/upload/file/pdf/v2/lcsc/2304140030_RALEC-RTT029760FTH_C11710.pdf; Manufacturer Part Number: RTT029760FTH; Package: 0402; Supplier 2: LCSC; Supplier Part Number 2: C11710
R3 R4 R6 R22 R26 R28 R29 R31-R33 R35-R38 R40 R41 = CRCW040233R0FKED: Manufacturer: Vishay Intertech; Tolerance: 1%; Temperature Coefficient: ±100ppm/?; Power Rating (mW): 63; ComponentLink1Description: Datasheet; ComponentLink1URL: https://wmsc.lcsc.com/wmsc/upload/file/pdf/v2/lcsc/2304140030_Vishay-Intertech-CRCW040233R0FKED_C242490.pdf; Manufacturer Part Number: CRCW040233R0FKED; Package: 0402; Supplier 2: LCSC; Supplier Part Number 2: C242490
R5 = 0402WGF1003TCE: Manufacturer: UNI-ROYAL(Uniroyal Elec); Power Rating (mW): 62.5; Tolerance: 1%; Temperature Coefficient: ±100ppm/?; Manufacturer Part Number: 0402WGF1003TCE; Package: 0402; Supplier 2: LCSC; Supplier Part Number 2: C25741; ComponentLink1Description: Datasheet; ComponentLink1URL: https://wmsc.lcsc.com/wmsc/upload/file/pdf/v2/lcsc/2206010100_UNI-ROYAL-Uniroyal-Elec-0402WGF1003TCE_C25741.pdf
R7 = ERJ2RKF1870X: Manufacturer: PANASONIC; Tolerance: 1%; Temperature Coefficient: ±100ppm/?; Power Rating (mW): 100; ComponentLink1Description: Datasheet; ComponentLink1URL: https://wmsc.lcsc.com/wmsc/upload/file/pdf/v2/lcsc/1912111437_PANASONIC-ERJ2RKF1870X_C416489.pdf; Manufacturer Part Number: ERJ2RKF1870X; Package: 0402; Supplier 2: LCSC; Supplier Part Number 2: C416489
R11 = CRCW04021R00FKEDC: Manufacturer: Vishay Intertech; Tolerance: 1%; Temperature Coefficient: ±100ppm/?; Power Rating (mW): 62.5; ComponentLink1Description: Datasheet; ComponentLink1URL: https://datasheet.lcsc.com/lcsc/2304140030_Vishay-Intertech-CRCW04021R00FKEDC_C2077765.pdf; Manufacturer Part Number: CRCW04021R00FKEDC; Package: 0402; Supplier 2: LCSC; Supplier Part Number 2: C2077765
R20 = AR05FTC1000: Manufacturer: Viking Tech; Tolerance: 1%; Temperature Coefficient: ±25ppm/?; ComponentLink1Description: Datasheet; ComponentLink1URL: https://wmsc.lcsc.com/wmsc/upload/file/pdf/v2/lcsc/2409280202_Viking-Tech-AR05FTC1000_C234699.pdf; Manufacturer Part Number: AR05FTC1000; Package: 0805; Power Rating (mW): 100; Supplier 2: LCSC; Supplier Part Number 2: C234699
R21 R34 R49 R52 R54 = 0402WGF1501TCE: Manufacturer: UNI-ROYAL(Uniroyal Elec); Tolerance: 1%; Temperature Coefficient: ±100ppm/?; Power Rating (mW): 62.5; ComponentLink1Description: Datasheet; ComponentLink1URL: https://wmsc.lcsc.com/wmsc/upload/file/pdf/v2/lcsc/2206010045_UNI-ROYAL-Uniroyal-Elec-0402WGF1501TCE_C25867.pdf; Manufacturer Part Number: 0402WGF1501TCE; Package: 0402; Supplier 2: LCSC; Supplier Part Number 2: C25867
R24 = 0402WGF1502TCE: Manufacturer: UNI-ROYAL(Uniroyal Elec); Power Rating (mW): 62.5; Tolerance: 1%; Temperature Coefficient: ±100ppm/?; Manufacturer Part Number: 0402WGF1502TCE; Package: 0402; Supplier 2: LCSC; Supplier Part Number 2: C25756; ComponentLink1Description: Datasheet; ComponentLink1URL: https://wmsc.lcsc.com/wmsc/upload/file/pdf/v2/lcsc/2206010100_UNI-ROYAL-Uniroyal-Elec-0402WGF1502TCE_C25756.pdf
R30 = 0402WGF1002TCE: Manufacturer: UNI-ROYAL(Uniroyal Elec); Tolerance: 1%; Temperature Coefficient: ±100ppm/?; Power Rating (mW): 62.5; ComponentLink1Description: Datasheet; ComponentLink1URL: https://wmsc.lcsc.com/wmsc/upload/file/pdf/v2/lcsc/2206010100_UNI-ROYAL-Uniroyal-Elec-0402WGF1002TCE_C25744.pdf; Manufacturer Part Number: 0402WGF1002TCE; Package: 0402; Supplier 2: LCSC; Supplier Part Number 2: C25744
R39 = 0402WGF1001TCE: Manufacturer: UNI-ROYAL(Uniroyal Elec); Tolerance: 1%; Temperature Coefficient: ±100ppm/?; Power Rating (mW): 62.5; ComponentLink1Description: Datasheet; ComponentLink1URL: https://wmsc.lcsc.com/wmsc/upload/file/pdf/v2/lcsc/2206010216_UNI-ROYAL-Uniroyal-Elec-0402WGF1001TCE_C11702.pdf; Manufacturer Part Number: 0402WGF1001TCE; Package: 0402; Supplier 2: LCSC; Supplier Part Number 2: C11702
S2 S3 = TS-1092S-B3D2-G: SWITCH TACTILE SPST-NO; Manufacturer: Yuandi; Manufacturer Part Number: TS-1092S-B3D2-G; ComponentLink1Description: Datasheet; ComponentLink1URL: https://www.lcsc.com/datasheet/lcsc_datasheet_2005071437_Yuandi-TS-1092S-B3D2-G_C520860.pdf; Supplier 2: LCSC; Supplier Part Number 2: C520860
TP1 TP2 TP62 TP63 = TEST_GRABBER: EMBEDDED TEST POINT FOR SALEAE TEST CLIPS; Manufacturer Part Number: TEST_GRABBER
U1 = STM32H563RGT6: ARM® Cortex®-M33 STM32H5 Microcontroller IC 32-Bit 250MHz 1MB (1M x 8) FLASH 64-LQFP (10x10); Manufacturer: ST Microelectronics; Manufacturer Part Number: STM32H563RGT6; Supplier 1: DigiKey; Supplier Part Number 1: 497-STM32H563RGT6-ND; Supplier 2: LCSC; Supplier Part Number 2: C22470894; ComponentLink1Description: Datasheet; ComponentLink1URL: https://www.st.com/resource/en/datasheet/stm32h562ag.pdf; ComponentLink2Description: Reference Manual; ComponentLink2URL: https://www.st.com/resource/en/reference_manual/rm0481-stm32h52333xx-stm32h56263xx-and-stm32h573xx-armbased-32bit-mcus-stmicroelectronics.pdf; Supplier 3: Mouser; Supplier Part Number 3: 511-STM32H563RGT6
X1 = XRCGB16M000FXN00R0: CRYSTAL 16.0000MHZ 6PF SMD; Manufacturer: Murata; Supplier 1: DigiKey; Supplier Part Number 1: 490-18282-1-ND; Manufacturer Part Number: XRCGB16M000FXN00R0; Supplier 2: LCSC; Supplier Part Number 2: C5222893; ComponentLink1Description: Datasheet; ComponentLink1URL: https://www.murata.com/products/productdata/8801076543518/SPEC-XRCGB25M000F3A00R0.pdf; Supplier 3: Mouser; Supplier Part Number 3: 81-XRCGB16M000FXN00R

## Sheet conn_usbc.SchDoc
size A
Used 2 times, as channels conn_usbc_power, conn_usbc_data. Parts and nets are listed once, with the designators drawn on the sheet.
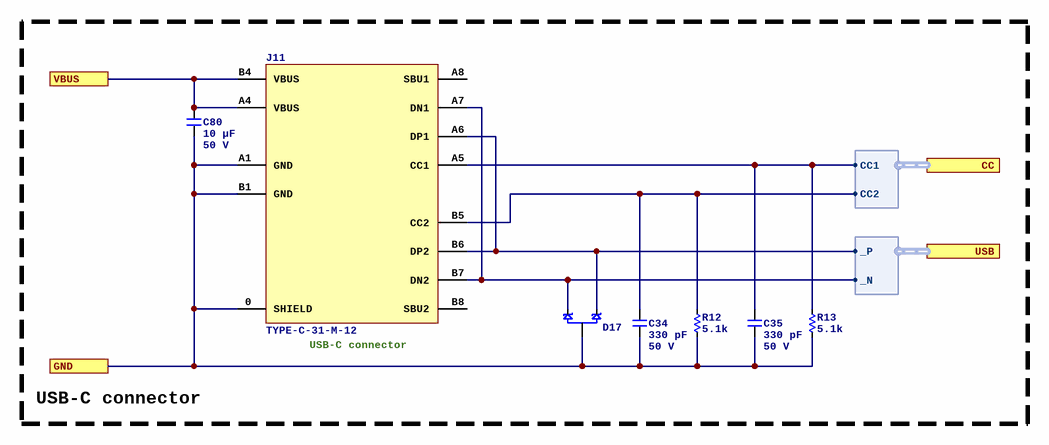
[diagram p8: conn_usbc.SchDoc]

### Parts
C34  Capacitance: 330 pF  Voltage Rating: 50 V  [C0402]  (hidden comment: CL05C331JB5NNNC)
C35  Capacitance: 330 pF  Voltage Rating: 50 V  [C0402]  (hidden comment: CL05C331JB5NNNC)
C80  Capacitance: 10 µF  Voltage Rating: 50 V  [C1206]  (hidden comment: CL31B106KBHNNNE)
D17  PESD2USB3UX  [3SOT23]  (value not drawn)
J11  TYPE-C-31-M-12  [CONN_USBC_TYPE-C-31-M-12]
R12  value 5.1k  [R0402]  (hidden comment: 0402WGF5101TCE)
R13  value 5.1k  [R0402]  (hidden comment: 0402WGF5101TCE)

### Ports
CC (harness CC), GND, USB (harness DIFF), VBUS

### Harnesses
DIFF: _P, _N
CC: CC2, CC1

### Nets
GND: C34.2 C35.2 C80.2 D17.3 J11.0(SHIELD) J11.A1(GND) J11.B1(GND) R12.2 R13.2 ; port GND
VBUS: C80.1 J11.A4(VBUS) J11.B4(VBUS) ; port VBUS
NetC34_1: C34.1 J11.B5(CC2) R12.1 ; port CC.CC2
NetC35_1: C35.1 J11.A5(CC1) R13.1 ; port CC.CC1
NetD17_1: D17.1 J11.A6(DP1) J11.B6(DP2) ; port USB._P
NetD17_2: D17.2 J11.A7(DN1) J11.B7(DN2) ; port USB._N

Not connected (* = marked no-connect by the designer): J11 A8(SBU1) B8(SBU2)

### Channels
conn_usbc_power: designators end in B; ports GND=GND VBUS=VBUS
conn_usbc_data: designators end in A; ports GND=GND VBUS=VBUS_DATA

### Notes on the sheet
- USB-C connector
- (near J11) USB-C connector

### Library data of the parts
C34 C35 = CL05C331JB5NNNC: Manufacturer: Samsung Electro-Mechanics; Dielectric: C0G; ComponentLink1URL: https://wmsc.lcsc.com/wmsc/upload/file/pdf/v2/lcsc/2304140030_Samsung-Electro-Mechanics-CL05C331JB5NNNC_C13533.pdf; ComponentLink1Description: Datasheet; Manufacturer Part Number: CL05C331JB5NNNC; Package: 0402; Supplier 2: LCSC; Supplier Part Number 2: C13533
C80 = CL31B106KBHNNNE: Manufacturer: Samsung Electro-Mechanics; Dielectric: X7R; ComponentLink1URL: https://wmsc.lcsc.com/wmsc/upload/file/pdf/v2/lcsc/1810221111_Samsung-Electro-Mechanics-CL31B106KBHNNNE_C89632.pdf; ComponentLink1Description: Datasheet; Manufacturer Part Number: CL31B106KBHNNNE; Package: 1206; Supplier 2: LCSC; Supplier Part Number 2: C89632
D17 = PESD2USB3UX: DIODE ESD USB SOT-23; Manufacturer: Nexperia USA Inc.; Polarity: Unidirectional; Capacitance (pF): 0.7; Standoff (V): 3.3; Min Breakdown Voltage: 4.2 V; Supplier 1: DigiKey; Supplier Part Number 1: 1727-PESD2USB3UX-CT-ND; Manufacturer Part Number: PESD2USB3UX; Supplier 2: LCSC; Supplier Part Number 2: C3708426; ComponentLink1Description: Datasheet; ComponentLink1URL: https://assets.nexperia.com/documents/data-sheet/PESD2USB3UX-T.pdf; Supplier 3: Mouser; Supplier Part Number 3: 771-PESD2USB3UX-TR
J11 = TYPE-C-31-M-12: 5A 1 16P Female Type-C SMD USB Connectors ROHS; Manufacturer: HRO Electronics; ComponentLink1Description: Product page; ComponentLink1URL: https://en.krhro.com/Product-Details/726.html; ComponentLink2Description: Drawing; ComponentLink2URL: https://omo-oss-file.thefastfile.com/portal-saas/new2023011311465142457/cms/file/95f41c83-14fa-41cb-9f86-8d6a717317e5.pdf; Manufacturer Part Number: TYPE-C-31-M-12; Supplier 2: LCSC; Supplier Part Number 2: C165948
R12 R13 = 0402WGF5101TCE: Manufacturer: UNI-ROYAL(Uniroyal Elec); Tolerance: 1%; Temperature Coefficient: ±100ppm/?; Power Rating (mW): 62.5; ComponentLink1Description: Datasheet; ComponentLink1URL: https://wmsc.lcsc.com/wmsc/upload/file/pdf/v2/lcsc/2206010045_UNI-ROYAL-Uniroyal-Elec-0402WGF5101TCE_C25905.pdf; Manufacturer Part Number: 0402WGF5101TCE; Package: 0402; Supplier 2: LCSC; Supplier Part Number 2: C25905

## Sheet eth_lan8742a_phy.SchDoc
size A
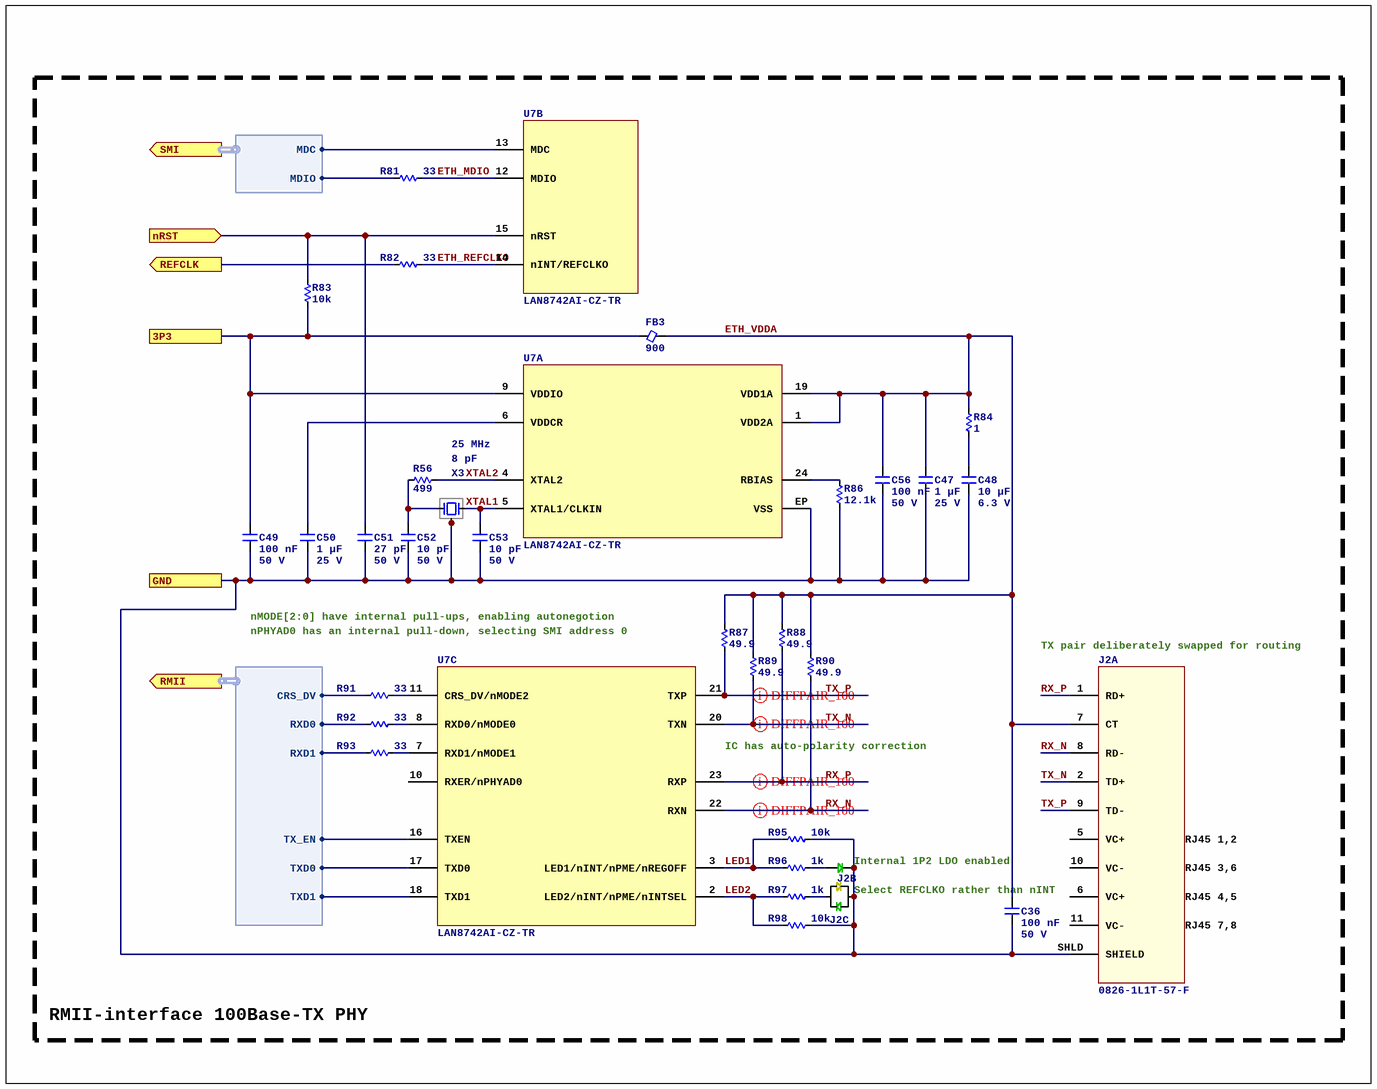
[diagram p9: eth_lan8742a_phy.SchDoc]

### Parts
C36  Capacitance: 100 nF  Voltage Rating: 50 V  [C0402]  (hidden comment: CL05B104KB54PNC)
C47  Capacitance: 1 µF  Voltage Rating: 25 V  [C0603]  (hidden comment: CL10B105KA8NNNC)
C48  Capacitance: 10 µF  Voltage Rating: 6.3 V  [C0805]  (hidden comment: CC0805KKX7R5BB106)
C49  Capacitance: 100 nF  Voltage Rating: 50 V  [C0402]  (hidden comment: CL05B104KB54PNC)
C50  Capacitance: 1 µF  Voltage Rating: 25 V  [C0603]  (hidden comment: CL10B105KA8NNNC)
C51  Capacitance: 27 pF  Voltage Rating: 50 V  [C0402]  (hidden comment: CC0402JRNPO9BN270)
C52  Capacitance: 10 pF  Voltage Rating: 50 V  [C0402]  (hidden comment: CL05C100JB5NNNC)
C53  Capacitance: 10 pF  Voltage Rating: 50 V  [C0402]  (hidden comment: CL05C100JB5NNNC)
C56  Capacitance: 100 nF  Voltage Rating: 50 V  [C0402]  (hidden comment: CL05B104KB54PNC)
FB3  Current Rating (mA): 900  [FB0402]  (hidden comment: BLM15PX601SN1D)
J2  0826-1L1T-57-F  [BELFUSE_0826-1L1T-57-F]  (parts A,B,C of 3)
R56  value 499  [R0402]  (hidden comment: 0402WGF4990TCE)
R81  value 33  [R0402]  (hidden comment: CRCW040233R0FKED)
R82  value 33  [R0402]  (hidden comment: CRCW040233R0FKED)
R83  value 10k  [R0402]  (hidden comment: 0402WGF1002TCE)
R84  value 1  [R0402]  (hidden comment: CRCW04021R00FKEDC)
R86  value 12.1k  [R0402]  (hidden comment: RC0402FR-0712K1L)
R87  value 49.9  [R0402]  (hidden comment: 0402WGF499JTCE)
R88  value 49.9  [R0402]  (hidden comment: 0402WGF499JTCE)
R89  value 49.9  [R0402]  (hidden comment: 0402WGF499JTCE)
R90  value 49.9  [R0402]  (hidden comment: 0402WGF499JTCE)
R91  value 33  [R0402]  (hidden comment: CRCW040233R0FKED)
R92  value 33  [R0402]  (hidden comment: CRCW040233R0FKED)
R93  value 33  [R0402]  (hidden comment: CRCW040233R0FKED)
R95  value 10k  [R0402]  (hidden comment: 0402WGF1002TCE)
R96  value 1k  [R0402]  (hidden comment: 0402WGF1001TCE)
R97  value 1k  [R0402]  (hidden comment: 0402WGF1001TCE)
R98  value 10k  [R0402]  (hidden comment: 0402WGF1002TCE)
U7  LAN8742AI-CZ-TR  [24QFN4E]  (parts A,B,C of 3)
X3  Frequency: 25 MHz  Capacitance: 8 pF  [4_SMD_2.0X1.6MM]  (hidden comment: ABM11W-25.0000MHZ-8-D1X-T3)

### Ports
3P3, GND, nRST (in), REFCLK (out), RMII (out, harness RMII), SMI (out, harness SMI)

### Harnesses
SMI: MDC, MDIO
RMII: CRS_DV, RXD0, RXD1, TX_EN, TXD0, TXD1

### Nets
3P3: C49.1 FB3.1 R83.1 U7.9(VDDIO) ; port 3P3
GND: C36.2 C47.2 C48.2 C49.2 C50.2 C51.2 C52.2 C53.2 C56.2 J2.13 J2.14 J2.SHLD(SHIELD) R86.2 R95.2 R98.2 U7.EP(VSS) X3.2 X3.4 ; port GND
ETH_MDIO: R81.1 U7.12(MDIO)
ETH_nRST: C51.1 R83.2 U7.15(nRST) ; port nRST
ETH_REFCLK: R82.2 ; port REFCLK
ETH_REFCLKO: R82.1 U7.14(nINT/REFCLKO)
ETH_VDDA: C36.1 C47.1 C56.1 FB3.2 J2.7(CT) R84.2 R87.1 R88.1 R89.1 R90.1 U7.1(VDD2A) U7.19(VDD1A)
LED1: R95.1 R96.2 U7.3(LED1/nINT/nPME/nREGOFF)
LED2: R97.2 R98.1 U7.2(LED2/nINT/nPME/nINTSEL)
RMII.CRS_DV: R91.2 ; port RMII.CRS_DV
RMII.RXD0: R92.2 ; port RMII.RXD0
RMII.RXD1: R93.2 ; port RMII.RXD1
RMII.TX_EN: U7.16(TXEN) ; port RMII.TX_EN
RMII.TXD0: U7.17(TXD0) ; port RMII.TXD0
RMII.TXD1: U7.18(TXD1) ; port RMII.TXD1
RX_N: J2.8(RD-) R90.2 U7.22(RXN)
RX_P: J2.1(RD+) R88.2 U7.23(RXP)
SMI.MDC: U7.13(MDC) ; port SMI.MDC
SMI.MDIO: R81.2 ; port SMI.MDIO
TX_N: J2.2(TD+) R89.2 U7.20(TXN)
TX_P: J2.9(TD-) R87.2 U7.21(TXP)
XTAL1: C53.1 U7.5(XTAL1/CLKIN) X3.3
XTAL2: R56.1 U7.4(XTAL2)
NetC48_1: C48.1 R84.1
NetC50_1: C50.1 U7.6(VDDCR)
NetC52_1: C52.1 R56.2 X3.1
NetJ2_12: J2.12 R97.1
NetJ2_15: J2.15 R96.1
NetR86_1: R86.1 U7.24(RBIAS)
NetR91_1: R91.1 U7.11(CRS_DV/nMODE2)
NetR92_1: R92.1 U7.8(RXD0/nMODE0)
NetR93_1: R93.1 U7.7(RXD1/nMODE1)

Not connected (* = marked no-connect by the designer): J2 5(VC+) 6(VC+) 10(VC-) 11(VC-); U7 10(RXER/nPHYAD0)

### Layout directives
differential pair; differential pair class DE_100: RX_N, RX_P, TX_N, TX_P

### Notes on the sheet
- nMODE[2:0] have internal pull-ups, enabling autonegotion
- nPHYAD0 has an internal pull-down, selecting SMI address 0
- (near J2) TX pair deliberately swapped for routing
- (near U7) IC has auto-polarity correction
- (near J2) Internal 1P2 LDO enabled
- Select REFCLKO rather than nINT
- RMII-interface 100Base-TX PHY
- (in symbol 0826-1L1T-57-F, part A) RJ45 1,2; RJ45 3,6; RJ45 4,5; RJ45 7,8

### Library data of the parts
C36 C49 C56 = CL05B104KB54PNC: as C3 on sheet mcu_stm32h563; ComponentLink1URL: https://wmsc.lcsc.com/wmsc/upload/file/pdf/v2/lcsc/2304140030_Samsung-Electro-Mechanics-CL05B104KB54PNC_C307331.pdf; ComponentLink1Description: Datasheet; Manufacturer Part Number: CL05B104KB54PNC; Package: 0402; Supplier 2: LCSC; Supplier Part Number 2: C307331
C47 C50 = CL10B105KA8NNNC: as C12 on sheet mcu_stm32h563; ComponentLink1URL: https://wmsc.lcsc.com/wmsc/upload/file/pdf/v2/lcsc/2304140030_Samsung-Electro-Mechanics-CL10B105KA8NNNC_C29936.pdf; ComponentLink1Description: Datasheet; Manufacturer Part Number: CL10B105KA8NNNC; Package: 0603; Supplier 2: LCSC; Supplier Part Number 2: C29936
C48 = CC0805KKX7R5BB106: Manufacturer: YAGEO; Dielectric: X7R; ComponentLink1URL: https://wmsc.lcsc.com/wmsc/upload/file/pdf/v2/lcsc/2409272300_YAGEO-CC0805KKX7R5BB106_C527225.pdf; ComponentLink1Description: Datasheet; Manufacturer Part Number: CC0805KKX7R5BB106; Package: 0805; Supplier 2: LCSC; Supplier Part Number 2: C527225
C51 = CC0402JRNPO9BN270: Manufacturer: YAGEO; Dielectric: NP0; ComponentLink1URL: https://wmsc.lcsc.com/wmsc/upload/file/pdf/v2/lcsc/2304140030_YAGEO-CC0402JRNPO9BN270_C107002.pdf; ComponentLink1Description: Datasheet; Manufacturer Part Number: CC0402JRNPO9BN270; Package: 0402; Supplier 2: LCSC; Supplier Part Number 2: C107002
C52 C53 = CL05C100JB5NNNC: Manufacturer: Samsung Electro-Mechanics; Dielectric: C0G; ComponentLink1URL: https://wmsc.lcsc.com/wmsc/upload/file/pdf/v2/lcsc/2304140030_Samsung-Electro-Mechanics-CL05C100JB5NNNC_C32949.pdf; ComponentLink1Description: Datasheet; Manufacturer Part Number: CL05C100JB5NNNC; Package: 0402; Supplier 2: LCSC; Supplier Part Number 2: C32949
FB3 = BLM15PX601SN1D: as FB1 on sheet mcu_stm32h563; ComponentLink1URL: https://wmsc.lcsc.com/wmsc/upload/file/pdf/v2/lcsc/2304140030_Murata-Electronics-BLM15PX601SN1D_C160977.pdf; ComponentLink1Description: Datasheet; Manufacturer Part Number: BLM15PX601SN1D; Supplier 2: LCSC; Supplier Part Number 2: C160977; Package: 0402
J2 = 0826-1L1T-57-F: CONN MAGJACK 1PORT 100 BASE-T; Manufacturer: Bel Fuse Inc; Supplier 1: DigiKey; Supplier Part Number 1: 507-1431-ND; ComponentLink1URL: https://www.belfuse.com/resources/drawings/magneticsolutions/dr-mag-0826-1l1t-57-f.pdf; ComponentLink1Description: Datasheet; Manufacturer Part Number: 0826-1L1T-57-F; Supplier 2: LCSC; Supplier Part Number 2: C3179913; Supplier 3: Mouser; Supplier Part Number 3: 530-0826-1L1T-57-F
R56 = 0402WGF4990TCE: Manufacturer: UNI-ROYAL(Uniroyal Elec); Tolerance: 1%; Temperature Coefficient: ±100ppm/?; Power Rating (mW): 62.5; ComponentLink1Description: Datasheet; ComponentLink1URL: https://wmsc.lcsc.com/wmsc/upload/file/pdf/v2/lcsc/2206010230_UNI-ROYAL-Uniroyal-Elec-0402WGF4990TCE_C4125.pdf; Manufacturer Part Number: 0402WGF4990TCE; Package: 0402; Supplier 2: LCSC; Supplier Part Number 2: C4125
R81 R82 R91-R93 = CRCW040233R0FKED: as R3 on sheet mcu_stm32h563; ComponentLink1Description: Datasheet; ComponentLink1URL: https://wmsc.lcsc.com/wmsc/upload/file/pdf/v2/lcsc/2304140030_Vishay-Intertech-CRCW040233R0FKED_C242490.pdf; Manufacturer Part Number: CRCW040233R0FKED; Package: 0402; Supplier 2: LCSC; Supplier Part Number 2: C242490
R83 R95 R98 = 0402WGF1002TCE: as R30 on sheet mcu_stm32h563; ComponentLink1Description: Datasheet; ComponentLink1URL: https://wmsc.lcsc.com/wmsc/upload/file/pdf/v2/lcsc/2206010100_UNI-ROYAL-Uniroyal-Elec-0402WGF1002TCE_C25744.pdf; Manufacturer Part Number: 0402WGF1002TCE; Package: 0402; Supplier 2: LCSC; Supplier Part Number 2: C25744
R84 = CRCW04021R00FKEDC: as R11 on sheet mcu_stm32h563; ComponentLink1Description: Datasheet; ComponentLink1URL: https://datasheet.lcsc.com/lcsc/2304140030_Vishay-Intertech-CRCW04021R00FKEDC_C2077765.pdf; Manufacturer Part Number: CRCW04021R00FKEDC; Package: 0402; Supplier 2: LCSC; Supplier Part Number 2: C2077765
R86 = RC0402FR-0712K1L: Manufacturer: YAGEO; Tolerance: 1%; Temperature Coefficient: ±100ppm/?; Power Rating (mW): 62.5; ComponentLink1Description: Datasheet; ComponentLink1URL: https://wmsc.lcsc.com/wmsc/upload/file/pdf/v2/lcsc/2304140030_YAGEO-RC0402FR-0712K1L_C132157.pdf; Manufacturer Part Number: RC0402FR-0712K1L; Package: 0402; Supplier 2: LCSC; Supplier Part Number 2: C132157
R87-R90 = 0402WGF499JTCE: Manufacturer: UNI-ROYAL(Uniroyal Elec); Tolerance: 1%; Temperature Coefficient: ±100ppm/?; Power Rating (mW): 62.5; ComponentLink1Description: Datasheet; ComponentLink1URL: https://wmsc.lcsc.com/wmsc/upload/file/pdf/v2/lcsc/2205311900_UNI-ROYAL-Uniroyal-Elec-0402WGF499JTCE_C25120.pdf; Manufacturer Part Number: 0402WGF499JTCE; Package: 0402; Supplier 2: LCSC; Supplier Part Number 2: C25120
R96 R97 = 0402WGF1001TCE: as R39 on sheet mcu_stm32h563; ComponentLink1Description: Datasheet; ComponentLink1URL: https://wmsc.lcsc.com/wmsc/upload/file/pdf/v2/lcsc/2206010216_UNI-ROYAL-Uniroyal-Elec-0402WGF1001TCE_C11702.pdf; Manufacturer Part Number: 0402WGF1001TCE; Package: 0402; Supplier 2: LCSC; Supplier Part Number 2: C11702
U7 = LAN8742AI-CZ-TR: Ethernet Transceiver, PQCC24; Manufacturer: Microchip; Supplier 1: DigiKey; Supplier Part Number 1: LAN8742AI-CZ-CT-ND; Manufacturer Part Number: LAN8742AI-CZ-TR; ComponentLink1URL: https://ww1.microchip.com/downloads/aemDocuments/documents/OTH/ProductDocuments/DataSheets/DS_LAN8742_00001989A.pdf; ComponentLink1Description: Datasheet; Supplier 2: LCSC; Supplier Part Number 2: C153279; Supplier 3: Mouser; Supplier Part Number 3: 579-LAN8742AI-CZ-TR
X3 = ABM11W-25.0000MHZ-8-D1X-T3: 25 MHz ±10ppm Crystal 8pF 50 Ohms 4-SMD, No Lead; Manufacturer: Abracon LLC; Supplier 1: DigiKey; Supplier Part Number 1: 535-13853-1-ND; Manufacturer Part Number: ABM11W-25.0000MHZ-8-D1X-T3; ComponentLink1Description: Datasheet; ComponentLink1URL: https://abracon.com/Resonators/ABM11W.pdf; Supplier 2: LCSC; Supplier Part Number 2: C1985767; Supplier 3: Mouser; Supplier Part Number 3: 815-11W25-8D1XT